# Altium project US29080671(A).PrjPCB (part 5 of 10)

## Sheet Z7_BLOCK.SchDoc
size A4
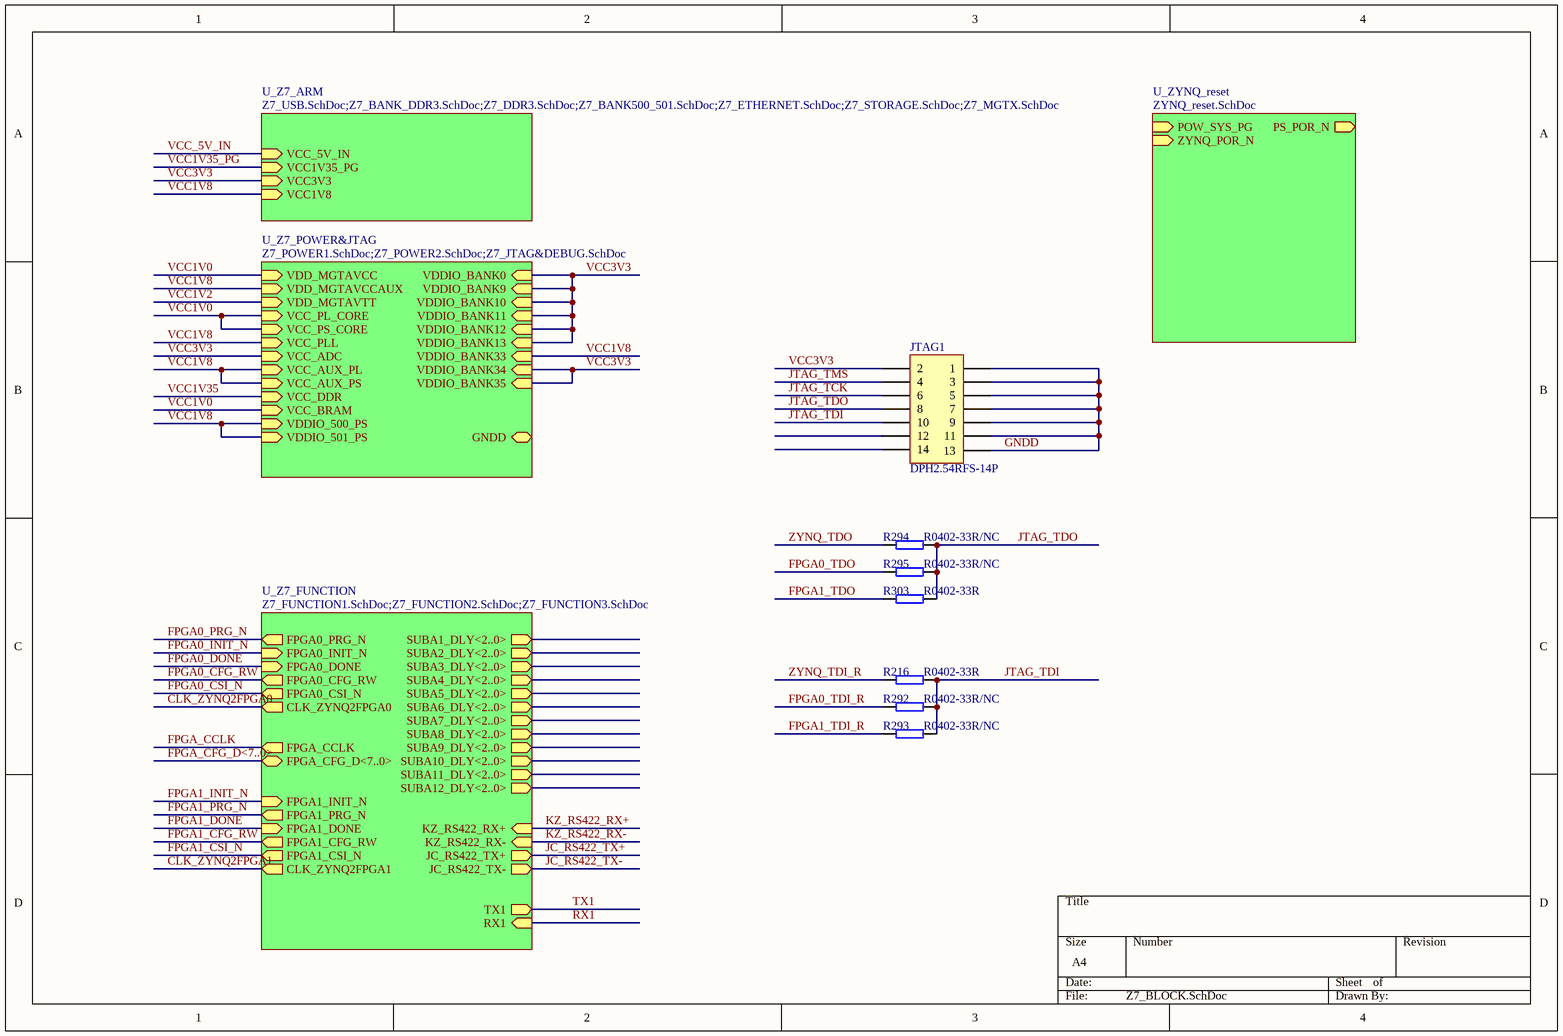
[diagram p22: Z7_BLOCK.SchDoc]

### Parts
JTAG1  DPH2.54RFS-14P  [IDC2.54-14]
R216  R0402-33R  [R0402]
R292  R0402-33R/NC  [R0402]
R293  R0402-33R/NC  [R0402]
R294  R0402-33R/NC  [R0402]
R295  R0402-33R/NC  [R0402]
R303  R0402-33R  [R0402]

### Sub-sheets
U_Z7_ARM = Z7_USB.SchDoc;Z7_BANK_DDR3.SchDoc;Z7_DDR3.SchDoc;Z7_BANK500_501.SchDoc;Z7_ETHERNET.SchDoc;Z7_STORAGE.SchDoc;Z7_MGTX.SchDoc: VCC_5V_IN (in), VCC1V35_PG (in), VCC3V3 (in), VCC1V8 (in)
U_Z7_FUNCTION = Z7_FUNCTION1.SchDoc;Z7_FUNCTION2.SchDoc;Z7_FUNCTION3.SchDoc: FPGA0_PRG_N (out), FPGA0_INIT_N (in), FPGA0_DONE (in), FPGA0_CFG_RW (out), FPGA0_CSI_N (out), FPGA_CCLK (out), FPGA_CFG_D<7..0> (bidir), JC_RS422_TX+ (out), JC_RS422_TX- (out), KZ_RS422_RX- (in), KZ_RS422_RX+ (in), FPGA1_INIT_N (in), FPGA1_PRG_N (out), FPGA1_DONE (in), FPGA1_CFG_RW (out), FPGA1_CSI_N (out), CLK_ZYNQ2FPGA0 (out), CLK_ZYNQ2FPGA1 (out), SUBA1_DLY<2..0> (out), SUBA2_DLY<2..0> (out), SUBA3_DLY<2..0> (out), SUBA4_DLY<2..0> (out), SUBA5_DLY<2..0> (out), SUBA6_DLY<2..0> (out), SUBA7_DLY<2..0> (out), SUBA8_DLY<2..0> (out), SUBA9_DLY<2..0> (out), SUBA10_DLY<2..0> (out), SUBA11_DLY<2..0> (out), SUBA12_DLY<2..0> (out), TX1 (out), RX1 (in)
U_Z7_POWER&JTAG = Z7_POWER1.SchDoc;Z7_POWER2.SchDoc;Z7_JTAG&DEBUG.SchDoc: VDD_MGTAVCC (in), VDD_MGTAVCCAUX (in), VDD_MGTAVTT (in), VCC_PL_CORE (in), VCC_PS_CORE (in), VDDIO_501_PS (in), VCC_PLL (in), VCC_ADC (in), VCC_AUX_PL (in), VCC_AUX_PS (in), VCC_DDR (in), VCC_BRAM (in), VDDIO_500_PS (in), GNDD, VDDIO_BANK0 (in), VDDIO_BANK9 (in), VDDIO_BANK10 (in), VDDIO_BANK11 (in), VDDIO_BANK13 (in), VDDIO_BANK33 (in), VDDIO_BANK34 (in), VDDIO_BANK35 (in), VDDIO_BANK12 (in)
U_ZYNQ_reset = ZYNQ_reset.SchDoc: POW_SYS_PG (in), ZYNQ_POR_N (in), PS_POR_N (out)

### Nets
GNDD: JTAG1.1 JTAG1.3 JTAG1.5 JTAG1.7 JTAG1.9 JTAG1.11 JTAG1.13
VCC1V0: sheet U_Z7_POWER&JTAG/VDD_MGTAVCC, sheet U_Z7_POWER&JTAG/VCC_PL_CORE, sheet U_Z7_POWER&JTAG/VCC_PS_CORE, sheet U_Z7_POWER&JTAG/VCC_BRAM
VCC1V8: sheet U_Z7_POWER&JTAG/VDD_MGTAVCCAUX, sheet U_Z7_POWER&JTAG/VDDIO_501_PS, sheet U_Z7_POWER&JTAG/VCC_PLL, sheet U_Z7_POWER&JTAG/VCC_AUX_PL, sheet U_Z7_POWER&JTAG/VCC_AUX_PS, sheet U_Z7_POWER&JTAG/VDDIO_500_PS, sheet U_Z7_POWER&JTAG/VDDIO_BANK33, sheet U_Z7_ARM/VCC1V8
VCC3V3: JTAG1.2 ; sheet U_Z7_POWER&JTAG/VCC_ADC, sheet U_Z7_POWER&JTAG/VDDIO_BANK0, sheet U_Z7_POWER&JTAG/VDDIO_BANK9, sheet U_Z7_POWER&JTAG/VDDIO_BANK10, sheet U_Z7_POWER&JTAG/VDDIO_BANK11, sheet U_Z7_POWER&JTAG/VDDIO_BANK13, sheet U_Z7_POWER&JTAG/VDDIO_BANK34, sheet U_Z7_POWER&JTAG/VDDIO_BANK35, sheet U_Z7_POWER&JTAG/VDDIO_BANK12, sheet U_Z7_ARM/VCC3V3
FPGA0_TDI_R: R292.1
FPGA0_TDO: R295.1
FPGA1_TDI_R: R293.1
FPGA1_TDO: R303.1
JTAG_TCK: JTAG1.6
JTAG_TDI: JTAG1.10 R216.2 R292.2 R293.2
JTAG_TDO: JTAG1.8 R294.2 R295.2 R303.2
JTAG_TMS: JTAG1.4
ZYNQ_TDI_R: R216.1
ZYNQ_TDO: R294.1

Not connected (* = marked no-connect by the designer): JTAG1 12 14

### Buses and harness runs
bus FPGA_CFG_D<7..0> = sheet U_Z7_FUNCTION/FPGA_CFG_D<7..0>

### Library data of the parts
JTAG1 = DPH2.54RFS-14P: 2.54间距14芯双排插针; Part_type: CONNECTOR; Manufacture: ANYCONN; Revision: 17-Jul-2002: Re-released for DXP Platform.; Part_number: DPH2.54RFS-14P; Value: DPH2.54RFS-14P; Schematic_Part: DPH2.54RFS-14P; PCB_Footprint: IDC2.54-14; datasheet: DataSheet\CON_ANYCONN_2.54 直针座.pdf#DataSheet\CON_ANYCONN_2.54%20直针座.pdf#
R216 R292-R295 R303 = R0402-10K: Manufacturer: SAMSUNG; Part_type: RES; Schematic_Part: RES; PCB_Footprint: R0402
  R216 R303: Part_number: R0402-33R; Value: R0402-33R
  R292-R295: Part_number: R0402-33R/NC; Value: R0402-33R/NC

## Sheet Z7_POWER1.SchDoc
size A3
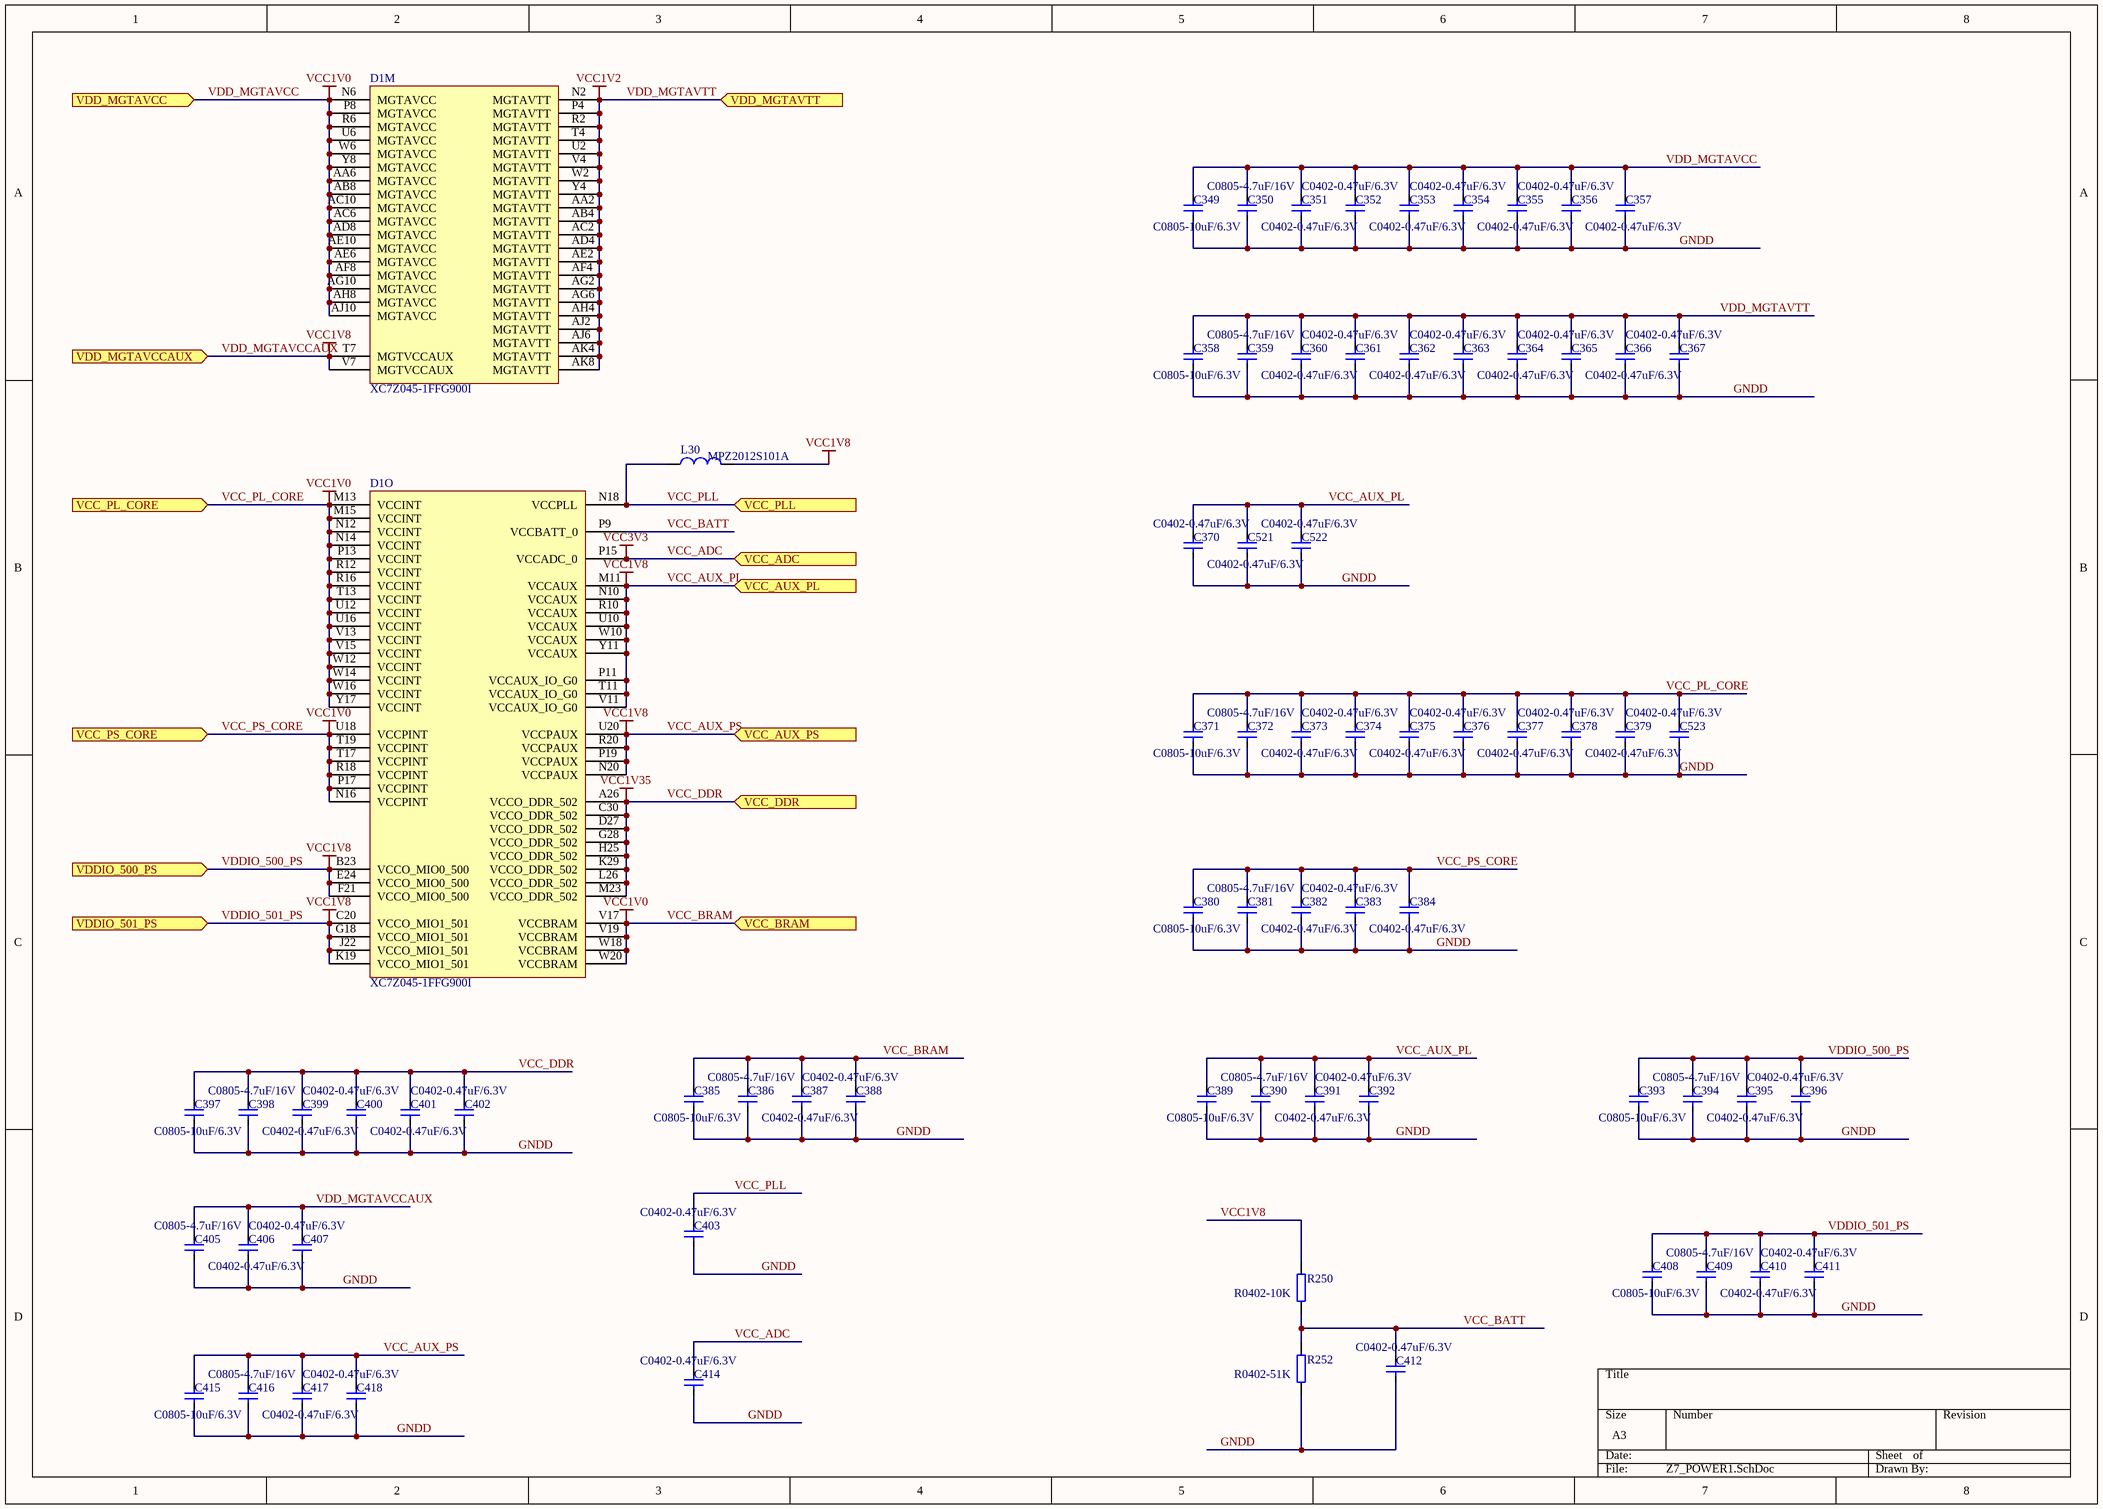
[diagram p23: Z7_POWER1.SchDoc]

### Parts
C349  C0805-10uF/6.3V  [C0805]
C350  C0805-4.7uF/16V  [C0805]
C351  C0402-0.47uF/6.3V  [C0402]
C352  C0402-0.47uF/6.3V  [C0402]
C353  C0402-0.47uF/6.3V  [C0402]
C354  C0402-0.47uF/6.3V  [C0402]
C355  C0402-0.47uF/6.3V  [C0402]
C356  C0402-0.47uF/6.3V  [C0402]
C357  C0402-0.47uF/6.3V  [C0402]
C358  C0805-10uF/6.3V  [C0805]
C359  C0805-4.7uF/16V  [C0805]
C360  C0402-0.47uF/6.3V  [C0402]
C361  C0402-0.47uF/6.3V  [C0402]
C362  C0402-0.47uF/6.3V  [C0402]
C363  C0402-0.47uF/6.3V  [C0402]
C364  C0402-0.47uF/6.3V  [C0402]
C365  C0402-0.47uF/6.3V  [C0402]
C366  C0402-0.47uF/6.3V  [C0402]
C367  C0402-0.47uF/6.3V  [C0402]
C370  C0402-0.47uF/6.3V  [C0402]
C371  C0805-10uF/6.3V  [C0805]
C372  C0805-4.7uF/16V  [C0805]
C373  C0402-0.47uF/6.3V  [C0402]
C374  C0402-0.47uF/6.3V  [C0402]
C375  C0402-0.47uF/6.3V  [C0402]
C376  C0402-0.47uF/6.3V  [C0402]
C377  C0402-0.47uF/6.3V  [C0402]
C378  C0402-0.47uF/6.3V  [C0402]
C379  C0402-0.47uF/6.3V  [C0402]
C380  C0805-10uF/6.3V  [C0805]
C381  C0805-4.7uF/16V  [C0805]
C382  C0402-0.47uF/6.3V  [C0402]
C383  C0402-0.47uF/6.3V  [C0402]
C384  C0402-0.47uF/6.3V  [C0402]
C385  C0805-10uF/6.3V  [C0805]
C386  C0805-4.7uF/16V  [C0805]
C387  C0402-0.47uF/6.3V  [C0402]
C388  C0402-0.47uF/6.3V  [C0402]
C389  C0805-10uF/6.3V  [C0805]
C390  C0805-4.7uF/16V  [C0805]
C391  C0402-0.47uF/6.3V  [C0402]
C392  C0402-0.47uF/6.3V  [C0402]
C393  C0805-10uF/6.3V  [C0805]
C394  C0805-4.7uF/16V  [C0805]
C395  C0402-0.47uF/6.3V  [C0402]
C396  C0402-0.47uF/6.3V  [C0402]
C397  C0805-10uF/6.3V  [C0805]
C398  C0805-4.7uF/16V  [C0805]
C399  C0402-0.47uF/6.3V  [C0402]
C400  C0402-0.47uF/6.3V  [C0402]
C401  C0402-0.47uF/6.3V  [C0402]
C402  C0402-0.47uF/6.3V  [C0402]
C403  C0402-0.47uF/6.3V  [C0402]
C405  C0805-4.7uF/16V  [C0805]
C406  C0402-0.47uF/6.3V  [C0402]
C407  C0402-0.47uF/6.3V  [C0402]
C408  C0805-10uF/6.3V  [C0805]
C409  C0805-4.7uF/16V  [C0805]
C410  C0402-0.47uF/6.3V  [C0402]
C411  C0402-0.47uF/6.3V  [C0402]
C412  C0402-0.47uF/6.3V  [C0402]
C414  C0402-0.47uF/6.3V  [C0402]
C415  C0805-10uF/6.3V  [C0805]
C416  C0805-4.7uF/16V  [C0805]
C417  C0402-0.47uF/6.3V  [C0402]
C418  C0402-0.47uF/6.3V  [C0402]
C521  C0402-0.47uF/6.3V  [C0402]
C522  C0402-0.47uF/6.3V  [C0402]
C523  C0402-0.47uF/6.3V  [C0402]
D1  XC7Z045-1FFG900I  [FFG900]  (parts M,O of 16)
L30  MPZ2012S101A  [R0805]
R250  R0402-10K  [R0402]
R252  R0402-51K  [R0402]

### Ports
VCC_ADC (in), VCC_AUX_PL (in), VCC_AUX_PS (in), VCC_BRAM (in), VCC_DDR (in), VCC_PL_CORE (in), VCC_PLL (in), VCC_PS_CORE (in), VDD_MGTAVCC (in), VDD_MGTAVCCAUX (in), VDD_MGTAVTT (in), VDDIO_500_PS (in), VDDIO_501_PS (in)

### Nets
GNDD: C349.2 C350.2 C351.2 C352.2 C353.2 C354.2 C355.2 C356.2 C357.2 C358.2 C359.2 C360.2 C361.2 C362.2 C363.2 C364.2 C365.2 C366.2 C367.2 C370.2 C371.2 C372.2 C373.2 C374.2 C375.2 C376.2 C377.2 C378.2 C379.2 C380.2 C381.2 C382.2 C383.2 C384.2 C385.2 C386.2 C387.2 C388.2 C389.2 C390.2 C391.2 C392.2 C393.2 C394.2 C395.2 C396.2 C397.2 C398.2 C399.2 C400.2 C401.2 C402.2 C403.2 C405.2 C406.2 C407.2 C408.2 C409.2 C410.2 C411.2 C412.2 C414.2 C415.2 C416.2 C417.2 C418.2 C521.2 C522.2 C523.2 R252.1
VCC1V0: C349.1 C350.1 C351.1 C352.1 C353.1 C354.1 C355.1 C356.1 C357.1 C371.1 C372.1 C373.1 C374.1 C375.1 C376.1 C377.1 C378.1 C379.1 C380.1 C381.1 C382.1 C383.1 C384.1 C385.1 C386.1 C387.1 C388.1 C523.1 D1.AA6(MGTAVCC) D1.AB8(MGTAVCC) D1.AC6(MGTAVCC) D1.AC10(MGTAVCC) D1.AD8(MGTAVCC) D1.AE6(MGTAVCC) D1.AE10(MGTAVCC) D1.AF8(MGTAVCC) D1.AG10(MGTAVCC) D1.AH8(MGTAVCC) D1.AJ10(MGTAVCC) D1.M13(VCCINT) D1.M15(VCCINT) D1.N6(MGTAVCC) D1.N12(VCCINT) D1.N14(VCCINT) D1.N16(VCCPINT) D1.P8(MGTAVCC) D1.P13(VCCINT) D1.P17(VCCPINT) D1.R6(MGTAVCC) D1.R12(VCCINT) D1.R16(VCCINT) D1.R18(VCCPINT) D1.T13(VCCINT) D1.T17(VCCPINT) D1.T19(VCCPINT) D1.U6(MGTAVCC) D1.U12(VCCINT) D1.U16(VCCINT) D1.U18(VCCPINT) D1.V13(VCCINT) D1.V15(VCCINT) D1.V17(VCCBRAM) D1.V19(VCCBRAM) D1.W6(MGTAVCC) D1.W12(VCCINT) D1.W14(VCCINT) D1.W16(VCCINT) D1.W18(VCCBRAM) D1.W20(VCCBRAM) D1.Y8(MGTAVCC) D1.Y17(VCCINT) ; port VDD_MGTAVCC, port VCC_PL_CORE, port VCC_PS_CORE, port VCC_BRAM  [also labelled VCC_BRAM, VCC_PL_CORE, VCC_PS_CORE, VDD_MGTAVCC]
VCC1V2: C358.1 C359.1 C360.1 C361.1 C362.1 C363.1 C364.1 C365.1 C366.1 C367.1 D1.AA2(MGTAVTT) D1.AB4(MGTAVTT) D1.AC2(MGTAVTT) D1.AD4(MGTAVTT) D1.AE2(MGTAVTT) D1.AF4(MGTAVTT) D1.AG2(MGTAVTT) D1.AG6(MGTAVTT) D1.AH4(MGTAVTT) D1.AJ2(MGTAVTT) D1.AJ6(MGTAVTT) D1.AK4(MGTAVTT) D1.AK8(MGTAVTT) D1.N2(MGTAVTT) D1.P4(MGTAVTT) D1.R2(MGTAVTT) D1.T4(MGTAVTT) D1.U2(MGTAVTT) D1.V4(MGTAVTT) D1.W2(MGTAVTT) D1.Y4(MGTAVTT) ; port VDD_MGTAVTT  [also labelled VDD_MGTAVTT]
VCC1V8: C370.1 C389.1 C390.1 C391.1 C392.1 C393.1 C394.1 C395.1 C396.1 C405.1 C406.1 C407.1 C408.1 C409.1 C410.1 C411.1 C415.1 C416.1 C417.1 C418.1 C521.1 C522.1 D1.B23(VCCO_MIO0_500) D1.C20(VCCO_MIO1_501) D1.E24(VCCO_MIO0_500) D1.F21(VCCO_MIO0_500) D1.G18(VCCO_MIO1_501) D1.J22(VCCO_MIO1_501) D1.K19(VCCO_MIO1_501) D1.M11(VCCAUX) D1.N10(VCCAUX) D1.N20(VCCPAUX) D1.P11(VCCAUX_IO_G0) D1.P19(VCCPAUX) D1.R10(VCCAUX) D1.R20(VCCPAUX) D1.T7(MGTVCCAUX) D1.T11(VCCAUX_IO_G0) D1.U10(VCCAUX) D1.U20(VCCPAUX) D1.V7(MGTVCCAUX) D1.V11(VCCAUX_IO_G0) D1.W10(VCCAUX) D1.Y11(VCCAUX) L30.2 R250.2 ; port VDD_MGTAVCCAUX, port VDDIO_501_PS, port VCC_AUX_PL, port VCC_AUX_PS, port VDDIO_500_PS  [also labelled VCC_AUX_PL, VCC_AUX_PS, VDD_MGTAVCCAUX, VDDIO_500_PS, VDDIO_501_PS]
VCC1V35: C397.1 C398.1 C399.1 C400.1 C401.1 C402.1 D1.A26(VCCO_DDR_502) D1.C30(VCCO_DDR_502) D1.D27(VCCO_DDR_502) D1.G28(VCCO_DDR_502) D1.H25(VCCO_DDR_502) D1.K29(VCCO_DDR_502) D1.L26(VCCO_DDR_502) D1.M23(VCCO_DDR_502) ; port VCC_DDR  [also labelled VCC_DDR]
VCC3V3: C414.1 D1.P15(VCCADC_0) ; port VCC_ADC  [also labelled VCC_ADC]
VCC_BATT: C412.1 D1.P9(VCCBATT_0) R250.1 R252.2
VCC_PLL: C403.1 D1.N18(VCCPLL) L30.1 ; port VCC_PLL

### Library data of the parts
C349 C358 C371 C380 C385 C389 C393 C397 C408 C415 = C1210-22uF/16V: Part_number: C0805-10uF/6.3V; Part_type: CAP; Value: C0805-10uF/6.3V; Schematic_Part: CAP; PCB_Footprint: C0805
C350 C359 C372 C381 C386 C390 C394 C398 C405 C409 C416 = C0805-4.7uF/50V: X7R; Manufacturer: SAMSUNG; Part_number: C0805-4.7uF/16V; Part_type: CAP; Value: C0805-4.7uF/16V; Schematic_Part: CAP; PCB_Footprint: C0805; datasheet: #DataSheet\C_Samsung_General Capacitors.pdf#
C351-C357 C360-C367 C370 C373-C379 C382-C384 C387 C388 C391 C392 C395 C396 C399-C403 C406 C407 C410-C412 C414 C417 C418 C521-C523 = C0402-0.1uF/16V: X7R; Manufacturer: SAMSUNG; Manufacturer_p/n: CL05X7R104KO5NNN; Part_number: C0402-0.47uF/6.3V; Part_type: CAP; Value: C0402-0.47uF/6.3V; temperature: -55℃\+125℃; Schematic_Part: CAP; PCB_Footprint: C0402; datasheet: #DataSheet\C_Samsung_General Capacitors.pdf#
D1 = XC7Z045-1FFG900I: 667 MHz Zynq?7000 AP SoC, 130 PS I/O, 378 FPGA I/O, 900-Ball BGA, Speed Grade 1, Industrial Grade, Pb-Free; Manufacturer: Xilinx; Extensible Block RAM (# 36Kb Blocks): 2180 KB (545); Flip Flops: 437200; LUTs: 218600; Speed Grade: -1; DatasheetVersion: v1.2; PackageVersion: Rev 1.1; PackageReference: FFG900; PackageDescription: Flip-Chip BGA, Body 31 x 31 mm, 1.0 mm Pitch; Generic Part Number: XC7Z045; RoHS: Pb-Free; Mounting Technology: Surface Mount; Code_JEDEC: MS-034-AAN-1; PartNumber: XC7Z045-1FFG900I; ComponentLink1Description: Datasheet; ComponentLink1URL: http://www.xilinx.com/support/documentation/data_sheets/ds190-Zynq-7000-Overview.pdf; ComponentLink2Description: Package Specification; ComponentLink2URL: http://www.xilinx.com/support/documentation/user_guides/ug865-Zynq-7000-Pkg-Pinout.pdf; ComponentLink3Description: DC and AC Switching Characteristics; ComponentLink3URL: http://www.xilinx.com/support/documentation/data_sheets/ds191-XC7Z030-XC7Z045-data-sheet.pdf; ComponentLink4Description: Package File; ComponentLink4URL: http://www.xilinx.com/support/packagefiles/z7packages/xc7z045ffg900pkg.txt; ComponentLink5Description: Packaging and Pinout; ComponentLink5URL: http://www.xilinx.com/support/documentation/user_guides/ug865-Zynq-7000-Pkg-Pinout.pdf; ComponentLink6Description: PCB and Layout Guide; ComponentLink6URL: http://www.xilinx.com/support/documentation/user_guides/ug483_7Series_PCB.pdf
L30 = FB0805-330R@100MHz: Manufacturer: TDK; Part_number: MPZ2012S101A; Part_type: BEAD; temperature: -55℃\+125℃; Value1: 330R@100MHz; Schematic_Part: BEAD; PCB_Footprint: R0805; Manufacturer_p/n: MPZ2012S101A
R250 R252 = R0402-10K: Manufacturer: SAMSUNG; Part_type: RES; Schematic_Part: RES; PCB_Footprint: R0402
  R250: Part_number: R0402-10K; Value: R0402-10K
  R252: Part_number: R0402-51K; Value: R0402-51K

## Sheet Z7_POWER2.SchDoc
size A3
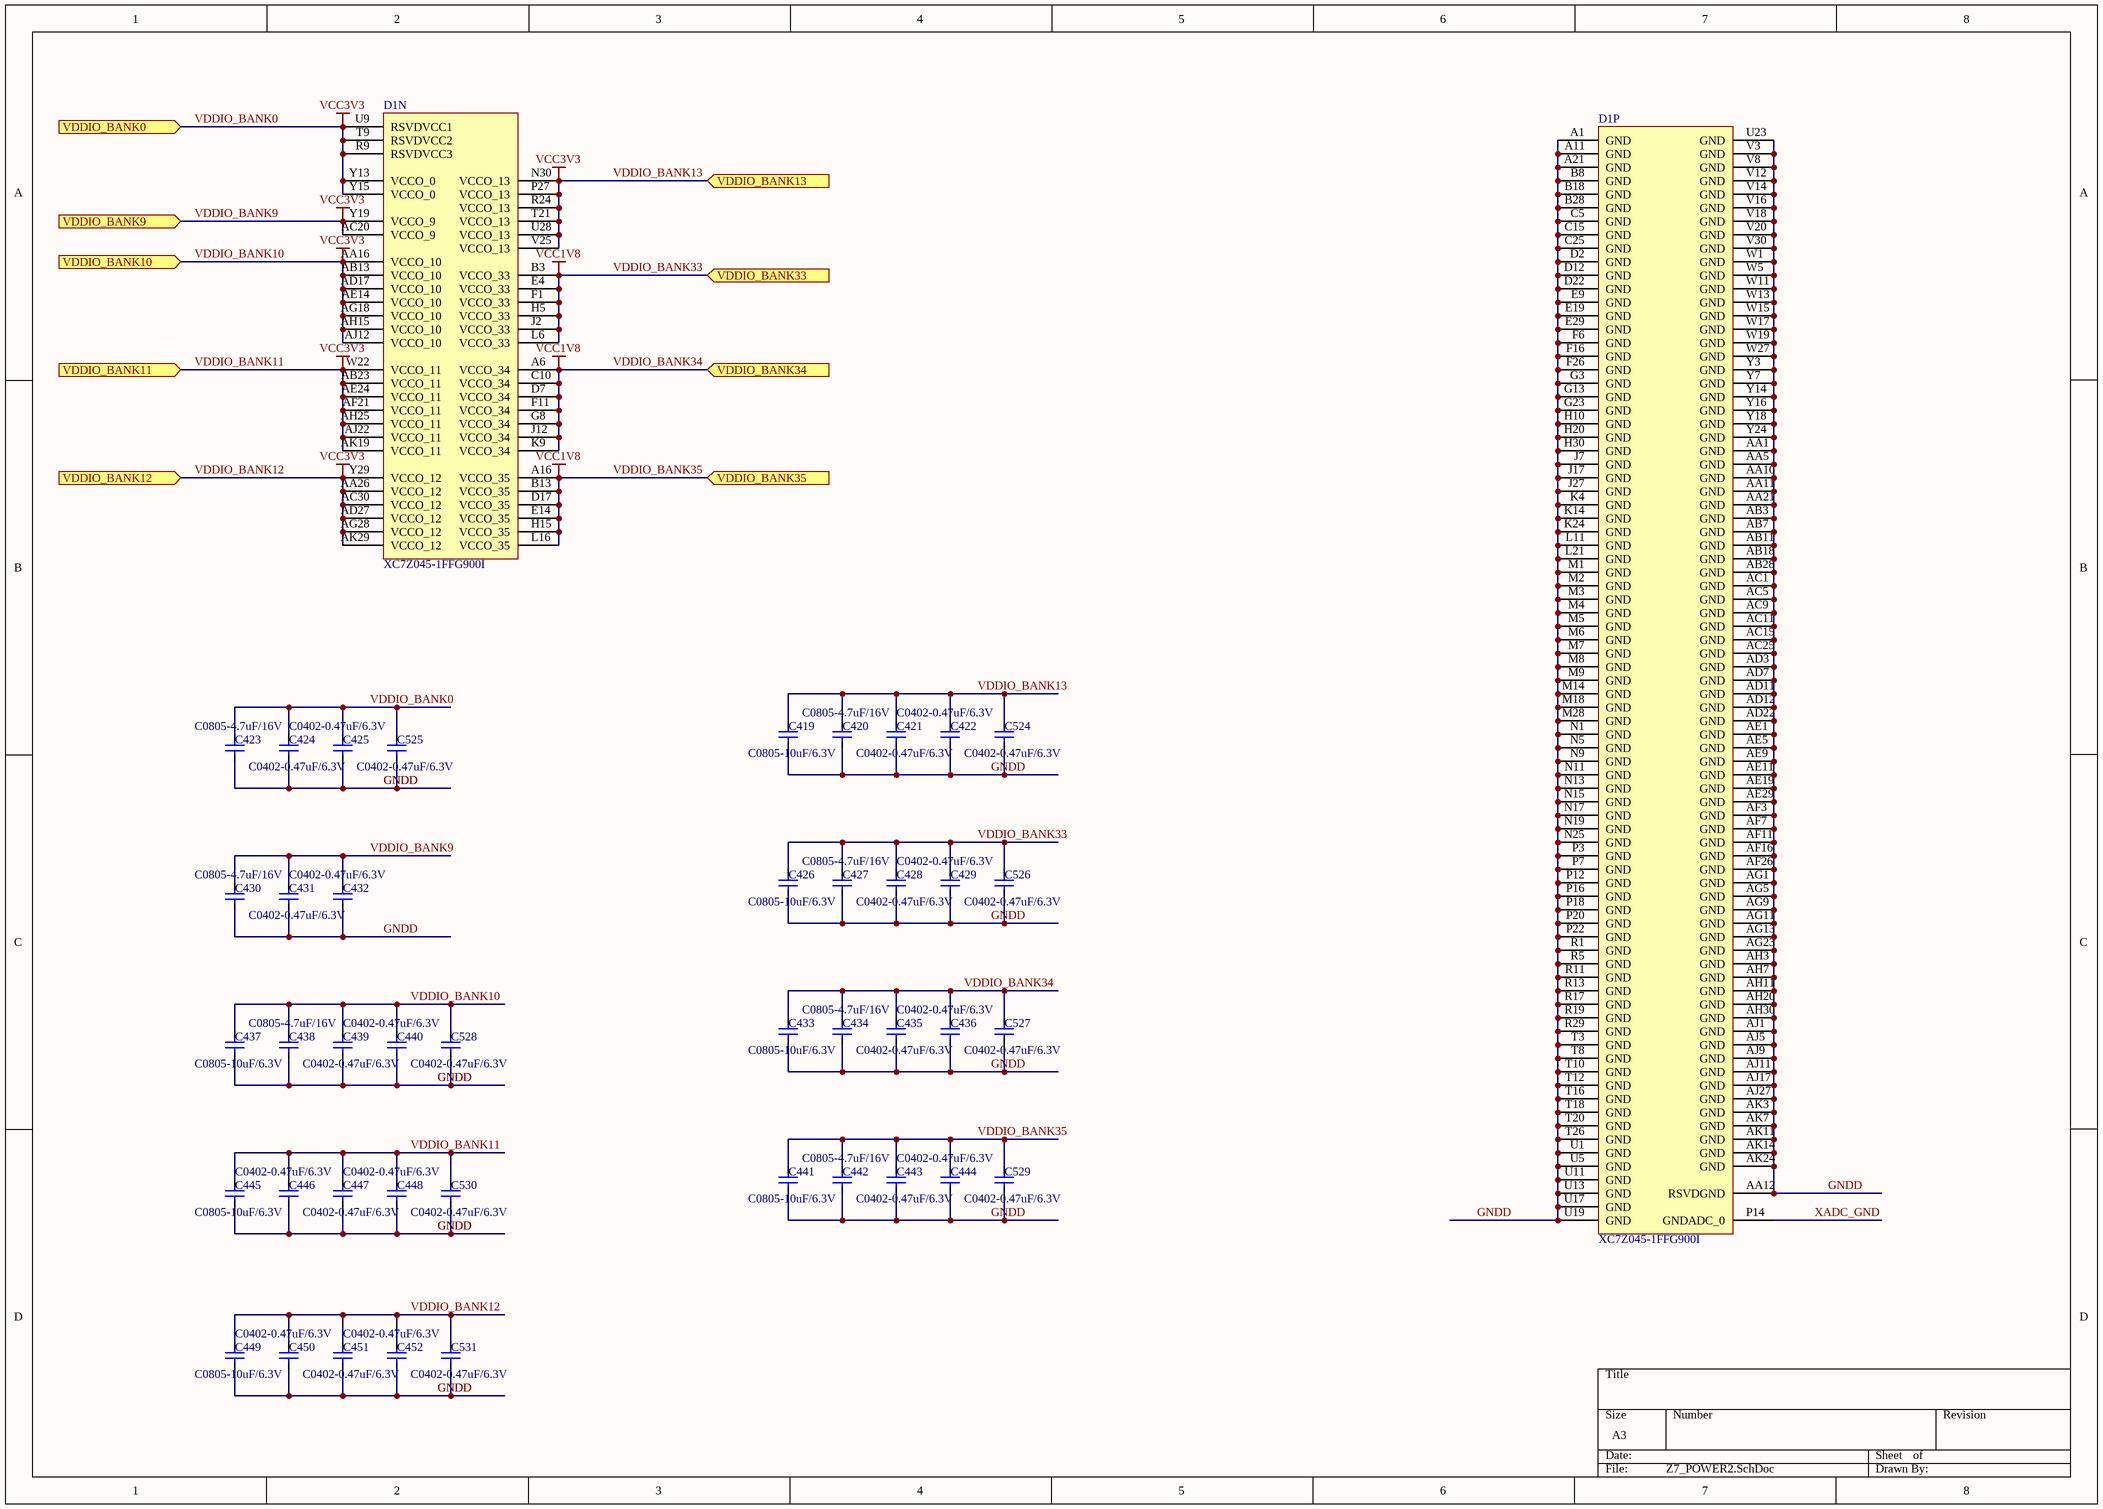
[diagram p24: Z7_POWER2.SchDoc]

### Parts
C419  C0805-10uF/6.3V  [C0805]
C420  C0805-4.7uF/16V  [C0805]
C421  C0402-0.47uF/6.3V  [C0402]
C422  C0402-0.47uF/6.3V  [C0402]
C423  C0805-4.7uF/16V  [C0805]
C424  C0402-0.47uF/6.3V  [C0402]
C425  C0402-0.47uF/6.3V  [C0402]
C426  C0805-10uF/6.3V  [C0805]
C427  C0805-4.7uF/16V  [C0805]
C428  C0402-0.47uF/6.3V  [C0402]
C429  C0402-0.47uF/6.3V  [C0402]
C430  C0805-4.7uF/16V  [C0805]
C431  C0402-0.47uF/6.3V  [C0402]
C432  C0402-0.47uF/6.3V  [C0402]
C433  C0805-10uF/6.3V  [C0805]
C434  C0805-4.7uF/16V  [C0805]
C435  C0402-0.47uF/6.3V  [C0402]
C436  C0402-0.47uF/6.3V  [C0402]
C437  C0805-10uF/6.3V  [C0805]
C438  C0805-4.7uF/16V  [C0805]
C439  C0402-0.47uF/6.3V  [C0402]
C440  C0402-0.47uF/6.3V  [C0402]
C441  C0805-10uF/6.3V  [C0805]
C442  C0805-4.7uF/16V  [C0805]
C443  C0402-0.47uF/6.3V  [C0402]
C444  C0402-0.47uF/6.3V  [C0402]
C445  C0805-10uF/6.3V  [C0805]
C446  C0402-0.47uF/6.3V  [C0402]
C447  C0402-0.47uF/6.3V  [C0402]
C448  C0402-0.47uF/6.3V  [C0402]
C449  C0805-10uF/6.3V  [C0805]
C450  C0402-0.47uF/6.3V  [C0402]
C451  C0402-0.47uF/6.3V  [C0402]
C452  C0402-0.47uF/6.3V  [C0402]
C524  C0402-0.47uF/6.3V  [C0402]
C525  C0402-0.47uF/6.3V  [C0402]
C526  C0402-0.47uF/6.3V  [C0402]
C527  C0402-0.47uF/6.3V  [C0402]
C528  C0402-0.47uF/6.3V  [C0402]
C529  C0402-0.47uF/6.3V  [C0402]
C530  C0402-0.47uF/6.3V  [C0402]
C531  C0402-0.47uF/6.3V  [C0402]
D1  XC7Z045-1FFG900I  [FFG900]  (parts N,P of 16)

### Ports
VDDIO_BANK0 (in), VDDIO_BANK9 (in), VDDIO_BANK10 (in), VDDIO_BANK11 (in), VDDIO_BANK12 (in), VDDIO_BANK13 (in), VDDIO_BANK33 (in), VDDIO_BANK34 (in), VDDIO_BANK35 (in)

### Nets
GNDD: C419.2 C420.2 C421.2 C422.2 C423.2 C424.2 C425.2 C426.2 C427.2 C428.2 C429.2 C430.2 C431.2 C432.2 C433.2 C434.2 C435.2 C436.2 C437.2 C438.2 C439.2 C440.2 C441.2 C442.2 C443.2 C444.2 C445.2 C446.2 C447.2 C448.2 C449.2 C450.2 C451.2 C452.2 C524.2 C525.2 C526.2 C527.2 C528.2 C529.2 C530.2 C531.2 D1.A1(GND) D1.A11(GND) D1.A21(GND) D1.AA1(GND) D1.AA5(GND) D1.AA10(GND) D1.AA11(GND) D1.AA12(RSVDGND) D1.AA21(GND) D1.AB3(GND) D1.AB7(GND) D1.AB11(GND) D1.AB18(GND) D1.AB28(GND) D1.AC1(GND) D1.AC5(GND) D1.AC9(GND) D1.AC11(GND) D1.AC15(GND) D1.AC25(GND) D1.AD3(GND) D1.AD7(GND) D1.AD11(GND) D1.AD12(GND) D1.AD22(GND) D1.AE1(GND) D1.AE5(GND) D1.AE9(GND) D1.AE11(GND) D1.AE19(GND) D1.AE29(GND) D1.AF3(GND) D1.AF7(GND) D1.AF11(GND) D1.AF16(GND) D1.AF26(GND) D1.AG1(GND) D1.AG5(GND) D1.AG9(GND) D1.AG11(GND) D1.AG13(GND) D1.AG23(GND) D1.AH3(GND) D1.AH7(GND) D1.AH11(GND) D1.AH20(GND) D1.AH30(GND) D1.AJ1(GND) D1.AJ5(GND) D1.AJ9(GND) D1.AJ11(GND) D1.AJ17(GND) D1.AJ27(GND) D1.AK3(GND) D1.AK7(GND) D1.AK11(GND) D1.AK14(GND) D1.AK24(GND) D1.B8(GND) D1.B18(GND) D1.B28(GND) D1.C5(GND) D1.C15(GND) D1.C25(GND) D1.D2(GND) D1.D12(GND) D1.D22(GND) D1.E9(GND) D1.E19(GND) D1.E29(GND) D1.F6(GND) D1.F16(GND) D1.F26(GND) D1.G3(GND) D1.G13(GND) D1.G23(GND) D1.H10(GND) D1.H20(GND) D1.H30(GND) D1.J7(GND) D1.J17(GND) D1.J27(GND) D1.K4(GND) D1.K14(GND) D1.K24(GND) D1.L11(GND) D1.L21(GND) D1.M1(GND) D1.M2(GND) D1.M3(GND) D1.M4(GND) D1.M5(GND) D1.M6(GND) D1.M7(GND) D1.M8(GND) D1.M9(GND) D1.M14(GND) D1.M18(GND) D1.M28(GND) D1.N1(GND) D1.N5(GND) D1.N9(GND) D1.N11(GND) D1.N13(GND) D1.N15(GND) D1.N17(GND) D1.N19(GND) D1.N25(GND) D1.P3(GND) D1.P7(GND) D1.P12(GND) D1.P16(GND) D1.P18(GND) D1.P20(GND) D1.P22(GND) D1.R1(GND) D1.R5(GND) D1.R11(GND) D1.R13(GND) D1.R17(GND) D1.R19(GND) D1.R29(GND) D1.T3(GND) D1.T8(GND) D1.T10(GND) D1.T12(GND) D1.T16(GND) D1.T18(GND) D1.T20(GND) D1.T26(GND) D1.U1(GND) D1.U5(GND) D1.U11(GND) D1.U13(GND) D1.U17(GND) D1.U19(GND) D1.U23(GND) D1.V3(GND) D1.V8(GND) D1.V12(GND) D1.V14(GND) D1.V16(GND) D1.V18(GND) D1.V20(GND) D1.V30(GND) D1.W1(GND) D1.W5(GND) D1.W11(GND) D1.W13(GND) D1.W15(GND) D1.W17(GND) D1.W19(GND) D1.W27(GND) D1.Y3(GND) D1.Y7(GND) D1.Y14(GND) D1.Y16(GND) D1.Y18(GND) D1.Y24(GND)
VCC1V8: C426.1 C427.1 C428.1 C429.1 C433.1 C434.1 C435.1 C436.1 C441.1 C442.1 C443.1 C444.1 C526.1 C527.1 C529.1 D1.A6(VCCO_34) D1.A16(VCCO_35) D1.B3(VCCO_33) D1.B13(VCCO_35) D1.C10(VCCO_34) D1.D7(VCCO_34) D1.D17(VCCO_35) D1.E4(VCCO_33) D1.E14(VCCO_35) D1.F1(VCCO_33) D1.F11(VCCO_34) D1.G8(VCCO_34) D1.H5(VCCO_33) D1.H15(VCCO_35) D1.J2(VCCO_33) D1.J12(VCCO_34) D1.K9(VCCO_34) D1.L6(VCCO_33) D1.L16(VCCO_35) ; port VDDIO_BANK33, port VDDIO_BANK34, port VDDIO_BANK35  [also labelled VDDIO_BANK33, VDDIO_BANK34, VDDIO_BANK35]
VCC3V3: C419.1 C420.1 C421.1 C422.1 C423.1 C424.1 C425.1 C430.1 C431.1 C432.1 C437.1 C438.1 C439.1 C440.1 C445.1 C446.1 C447.1 C448.1 C449.1 C450.1 C451.1 C452.1 C524.1 C525.1 C528.1 C530.1 C531.1 D1.AA16(VCCO_10) D1.AA26(VCCO_12) D1.AB13(VCCO_10) D1.AB23(VCCO_11) D1.AC20(VCCO_9) D1.AC30(VCCO_12) D1.AD17(VCCO_10) D1.AD27(VCCO_12) D1.AE14(VCCO_10) D1.AE24(VCCO_11) D1.AF21(VCCO_11) D1.AG18(VCCO_10) D1.AG28(VCCO_12) D1.AH15(VCCO_10) D1.AH25(VCCO_11) D1.AJ12(VCCO_10) D1.AJ22(VCCO_11) D1.AK19(VCCO_11) D1.AK29(VCCO_12) D1.N30(VCCO_13) D1.P27(VCCO_13) D1.R9(RSVDVCC3) D1.R24(VCCO_13) D1.T9(RSVDVCC2) D1.T21(VCCO_13) D1.U9(RSVDVCC1) D1.U28(VCCO_13) D1.V25(VCCO_13) D1.W22(VCCO_11) D1.Y13(VCCO_0) D1.Y15(VCCO_0) D1.Y19(VCCO_9) D1.Y29(VCCO_12) ; port VDDIO_BANK0, port VDDIO_BANK9, port VDDIO_BANK10, port VDDIO_BANK11, port VDDIO_BANK13, port VDDIO_BANK12  [also labelled VDDIO_BANK0, VDDIO_BANK10, VDDIO_BANK11, VDDIO_BANK12, VDDIO_BANK13, VDDIO_BANK9]
XADC_GND: D1.P14(GNDADC_0)

### Library data of the parts
C419 C426 C433 C437 C441 C445 C449 = C1210-22uF/16V: Part_number: C0805-10uF/6.3V; Part_type: CAP; Value: C0805-10uF/6.3V; Schematic_Part: CAP; PCB_Footprint: C0805
C420 C423 C427 C430 C434 C438 C442 = C0805-4.7uF/50V: X7R; Manufacturer: SAMSUNG; Part_number: C0805-4.7uF/16V; Part_type: CAP; Value: C0805-4.7uF/16V; Schematic_Part: CAP; PCB_Footprint: C0805; datasheet: #DataSheet\C_Samsung_General Capacitors.pdf#
C421 C422 C424 C425 C428 C429 C431 C432 C435 C436 C439 C440 C443 C444 C446-C448 C450-C452 C524-C531 = C0402-0.1uF/16V: as C351-C357 on sheet Z7_POWER1; Part_number: C0402-0.47uF/6.3V; Part_type: CAP; Value: C0402-0.47uF/6.3V; temperature: -55℃\+125℃; Schematic_Part: CAP; PCB_Footprint: C0402; datasheet: #DataSheet\C_Samsung_General Capacitors.pdf#
D1 = XC7Z045-1FFG900I: as D1 on sheet Z7_POWER1; DatasheetVersion: v1.2; PackageVersion: Rev 1.1; PackageReference: FFG900; PackageDescription: Flip-Chip BGA, Body 31 x 31 mm, 1.0 mm Pitch; Generic Part Number: XC7Z045; RoHS: Pb-Free; Mounting Technology: Surface Mount; Code_JEDEC: MS-034-AAN-1; PartNumber: XC7Z045-1FFG900I; ComponentLink1Description: Datasheet; ComponentLink1URL: http://www.xilinx.com/support/documentation/data_sheets/ds190-Zynq-7000-Overview.pdf; ComponentLink2Description: Package Specification; ComponentLink2URL: http://www.xilinx.com/support/documentation/user_guides/ug865-Zynq-7000-Pkg-Pinout.pdf; ComponentLink3Description: DC and AC Switching Characteristics; ComponentLink3URL: http://www.xilinx.com/support/documentation/data_sheets/ds191-XC7Z030-XC7Z045-data-sheet.pdf; ComponentLink4Description: Package File; ComponentLink4URL: http://www.xilinx.com/support/packagefiles/z7packages/xc7z045ffg900pkg.txt; ComponentLink5Description: Packaging and Pinout; ComponentLink5URL: http://www.xilinx.com/support/documentation/user_guides/ug865-Zynq-7000-Pkg-Pinout.pdf; ComponentLink6Description: PCB and Layout Guide; ComponentLink6URL: http://www.xilinx.com/support/documentation/user_guides/ug483_7Series_PCB.pdf

## Sheet Z7_JTAG&DEBUG.SchDoc
size A3
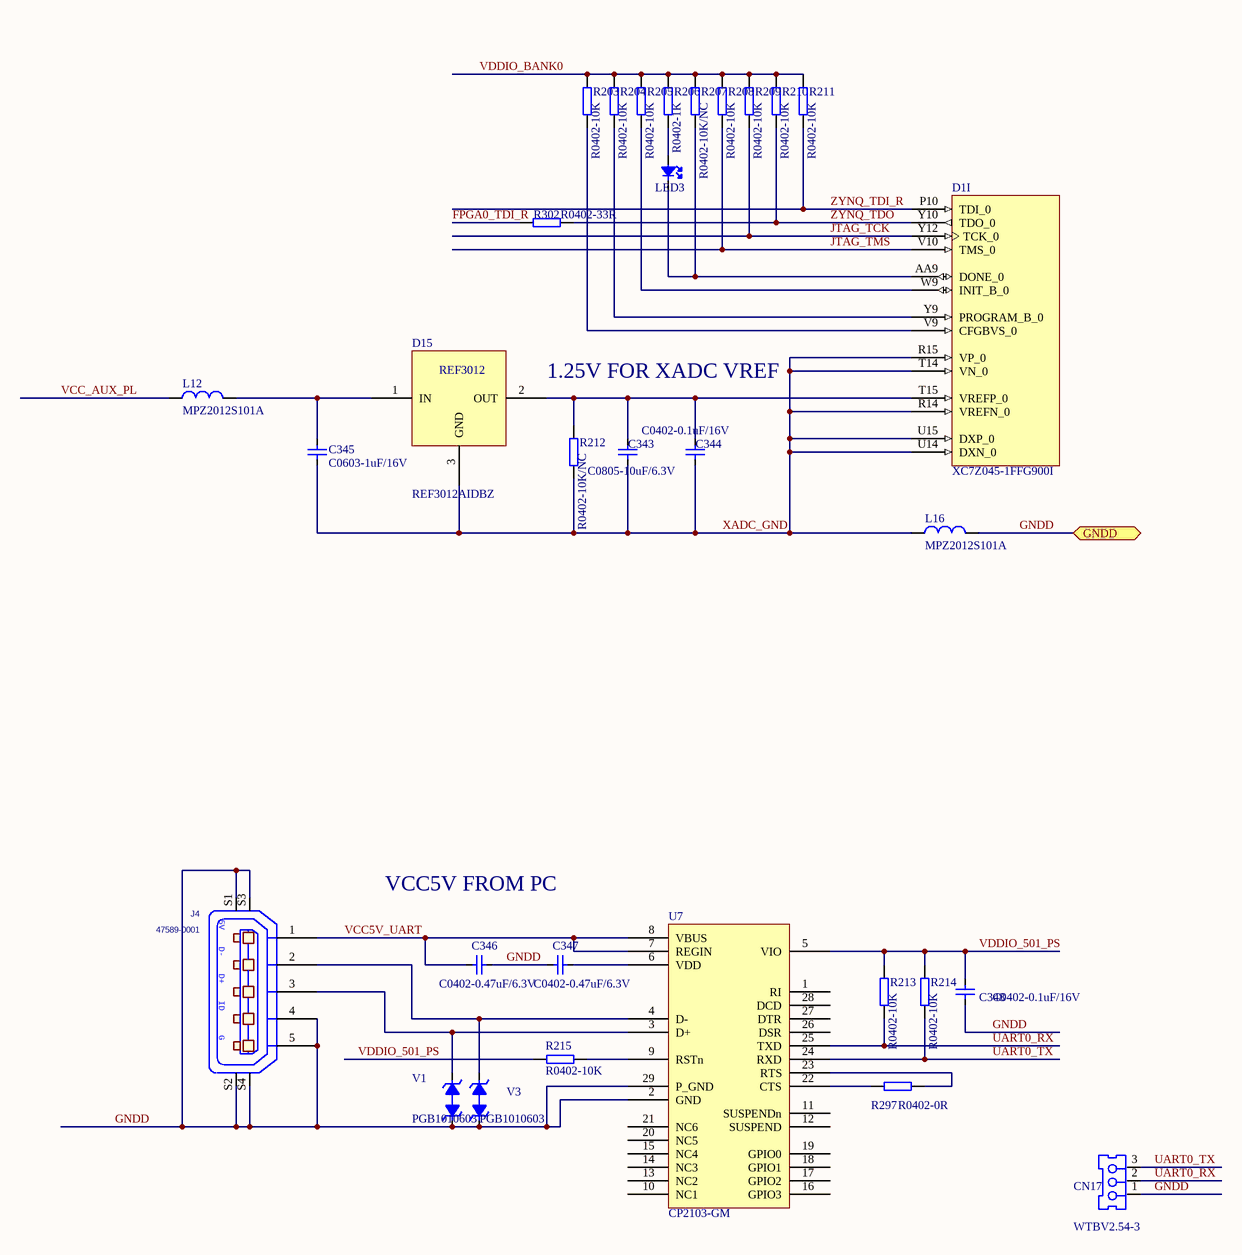
[diagram p25: Z7_JTAG&DEBUG.SchDoc]

### Parts
C343  C0805-10uF/6.3V  [C0805]
C344  C0402-0.1uF/16V  [C0402]
C345  C0603-1uF/16V  [C0603]
C346  C0402-0.47uF/6.3V  [C0402]
C347  C0402-0.47uF/6.3V  [C0402]
C348  C0402-0.1uF/16V  [C0402]
CN17  WTBV2.54-3  [WTB2.54-3V]
D1  XC7Z045-1FFG900I  [FFG900]  (part I of 16)
D15  REF3012AIDBZ  [SOT-23]
J4  47589-0001  [con5_microusb]
L12  MPZ2012S101A  [R0805]
L16  MPZ2012S101A  [R0805]
LED3  LED0603-GREEN  [LED-R0603]  (value not drawn)
R203  R0402-10K  [R0402]
R204  R0402-10K  [R0402]
R205  R0402-10K  [R0402]
R206  R0402-1K  [R0402]
R207  R0402-10K/NC  [R0402]
R208  R0402-10K  [R0402]
R209  R0402-10K  [R0402]
R210  R0402-10K  [R0402]
R211  R0402-10K  [R0402]
R212  R0402-10K/NC  [R0402]
R213  R0402-10K  [R0402]
R214  R0402-10K  [R0402]
R215  R0402-10K  [R0402]
R297  R0402-0R  [R0402]
R302  R0402-33R  [R0402]
U7  CP2103-GM  [QFN-28]
V1  PGB1010603  [R0603]
V3  PGB1010603  [R0603]

### Ports
GNDD

### Nets
GNDD: C346.2 C347.1 C348.2 CN17.1 J4.4(P4) J4.5(P5) J4.S1(SHLD1) J4.S2(SHLD2) J4.S3(SHLD3) J4.S4(SHLD4) L16.2 U7.2(GND) U7.29(P_GND) V1.1(ANODE) V3.1(ANODE) ; port GNDD
VCC_AUX_PL: C348.1 L12.1 R213.1 R214.1 R215.1 U7.5(VIO)  [also labelled VDDIO_501_PS]  [project net VCC1V8]
VDDIO_BANK0: R203.1 R204.1 R205.1 R206.1 R207.1 R208.1 R209.1 R210.1 R211.1  [project net VCC3V3]
FPGA0_TDI_R: R302.1
JTAG_TCK: D1.Y12(TCK_0) R209.2
JTAG_TMS: D1.V10(TMS_0) R208.2
UART0_RX: CN17.2 R213.2 U7.25(TXD)
UART0_TX: CN17.3 R214.2 U7.24(RXD)
VCC5V_UART: C346.1 J4.1(P1) U7.7(REGIN) U7.8(VBUS)
XADC_GND: C343.2 C344.2 C345.2 D1.R14(VREFN_0) D1.R15(VP_0) D1.T14(VN_0) D1.U14(DXN_0) D1.U15(DXP_0) D15.3(GND) L16.1 R212.2
ZYNQ_TDI_R: D1.P10(TDI_0) R211.2
ZYNQ_TDO: D1.Y10(TDO_0) R210.2 R302.2
NetC343_1: C343.1 C344.1 D1.T15(VREFP_0) D15.2(OUT) R212.1
NetC345_1: C345.1 D15.1(IN) L12.2
NetC347_2: C347.2 U7.6(VDD)
NetD1_AA9: D1.AA9(DONE_0) LED3.2(K) R207.2
NetD1_V9: D1.V9(CFGBVS_0) R203.2
NetD1_W9: D1.W9(INIT_B_0) R205.2
NetD1_Y9: D1.Y9(PROGRAM_B_0) R204.2
NetJ4_2: J4.2(P2) U7.4(D-) V3.2(CATHODE)
NetJ4_3: J4.3(P3) U7.3(D+) V1.2(CATHODE)
NetLED3_1: LED3.1(A) R206.2
NetR215_2: R215.2 U7.9(RSTn)
NetR297_1: R297.1 U7.22(CTS)
NetR297_2: R297.2 U7.23(RTS)

Not connected (* = marked no-connect by the designer): U7 1(RI) 10(NC1) 11(SUSPENDn) 12(SUSPEND) 13(NC2) 14(NC3) 15(NC4) 16(GPIO3) 17(GPIO2) 18(GPIO1) 19(GPIO0) 20(NC5) 21(NC6) 26(DSR) 27(DTR) 28(DCD)

### Notes on the sheet
- 1.25V FOR XADC VREF
- VCC5V FROM PC
- (in symbol USB_MINI_AB_RECEPTACLE) 5V; D-; D+; ID; G

### Library data of the parts
C343 = C1210-22uF/16V: Part_number: C0805-10uF/6.3V; Part_type: CAP; Value: C0805-10uF/6.3V; Schematic_Part: CAP; PCB_Footprint: C0805
C344 C346-C348 = C0402-0.1uF/16V: as C351-C357 on sheet Z7_POWER1; Part_type: CAP; temperature: -55℃\+125℃; Schematic_Part: CAP; PCB_Footprint: C0402; datasheet: #DataSheet\C_Samsung_General Capacitors.pdf#
  C344 C348: Part_number: C0402-0.1uF/16V; Value: C0402-0.1uF/16V
  C346 C347: Part_number: C0402-0.47uF/6.3V; Value: C0402-0.47uF/6.3V
C345 = C0603-100nF/16V: X7R; Part_number: C0603-1uF/16V; Part_type: CAP; Value: C0603-1uF/16V; temperature: -55℃\+125℃; Schematic_Part: CAP; PCB_Footprint: C0603
CN17 = WTBV2_0.54-3
D1 = XC7Z045-1FFG900I: as D1 on sheet Z7_POWER1; DatasheetVersion: v1.2; PackageVersion: Rev 1.1; PackageReference: FFG900; PackageDescription: Flip-Chip BGA, Body 31 x 31 mm, 1.0 mm Pitch; Generic Part Number: XC7Z045; RoHS: Pb-Free; Mounting Technology: Surface Mount; Code_JEDEC: MS-034-AAN-1; PartNumber: XC7Z045-1FFG900I; ComponentLink1Description: Datasheet; ComponentLink1URL: http://www.xilinx.com/support/documentation/data_sheets/ds190-Zynq-7000-Overview.pdf; ComponentLink2Description: Package Specification; ComponentLink2URL: http://www.xilinx.com/support/documentation/user_guides/ug865-Zynq-7000-Pkg-Pinout.pdf; ComponentLink3Description: DC and AC Switching Characteristics; ComponentLink3URL: http://www.xilinx.com/support/documentation/data_sheets/ds191-XC7Z030-XC7Z045-data-sheet.pdf; ComponentLink4Description: Package File; ComponentLink4URL: http://www.xilinx.com/support/packagefiles/z7packages/xc7z045ffg900pkg.txt; ComponentLink5Description: Packaging and Pinout; ComponentLink5URL: http://www.xilinx.com/support/documentation/user_guides/ug865-Zynq-7000-Pkg-Pinout.pdf; ComponentLink6Description: PCB and Layout Guide; ComponentLink6URL: http://www.xilinx.com/support/documentation/user_guides/ug483_7Series_PCB.pdf
J4 = USB_MINI_AB_RECEPTACLE: MOLEX MICRO USB AB 5; CLASS: IO; FPLIST: con5_microusb,con5_microusb_cust; CAD_APPROVED: Yes; DESCRIPTION: CON 1X5 USB_MICRO_AB_RECEPTACLE RA SMT 0.65MM SP 105H AU; AGILE_PN: 211-78722; HEIGHT: 2.65MM; ROHS: Yes; MFG_PN01: 47589-0001; MFG_NAME01: Molex
L12 L16 = FB0805-330R@100MHz: Manufacturer: TDK; Part_number: MPZ2012S101A; Part_type: BEAD; temperature: -55℃\+125℃; Value1: 330R@100MHz; Schematic_Part: BEAD; PCB_Footprint: R0805; Manufacturer_p/n: MPZ2012S101A
LED3 = LED-R_3: 表贴发光二极管, 0603封装, 体积1.6x0.8mm, 绿色, 高度0.8mm; Part_number: LED0603-GREEN
R203-R215 R297 R302 = R0402-10K: Manufacturer: SAMSUNG; Part_type: RES; Schematic_Part: RES; PCB_Footprint: R0402
  R203-R205 R208-R211 R213-R215: Part_number: R0402-10K; Value: R0402-10K
  R206: Part_number: R0402-1K; Value: R0402-1K
  R207 R212: Part_number: R0402-10K/NC; Value: R0402-10K/NC
  R297: Part_number: R0402-0R; Value: R0402-0R
  R302: Part_number: R0402-33R; Value: R0402-33R
U7 = CP2103: Part_number: CP2103-GM
V1 V3 = PGB1010603: U_Protector_PGB1 Series Lead-Free 0603 Surface Mount ESD Suppressor_PGB1010603_SMT_SOCM-1608_L1.6×W0.78×H0.35mm; Manufacturer: Littelfuse; Designer: WHG; Manufacturer Part Number: PGB1010603; Design Date: 2016.3.24; Value: PGB1010603
D15 = REF3012AIDBZ: Part_number: REF3012AIDBZ

## Sheet Z7_USB.SchDoc
size A3
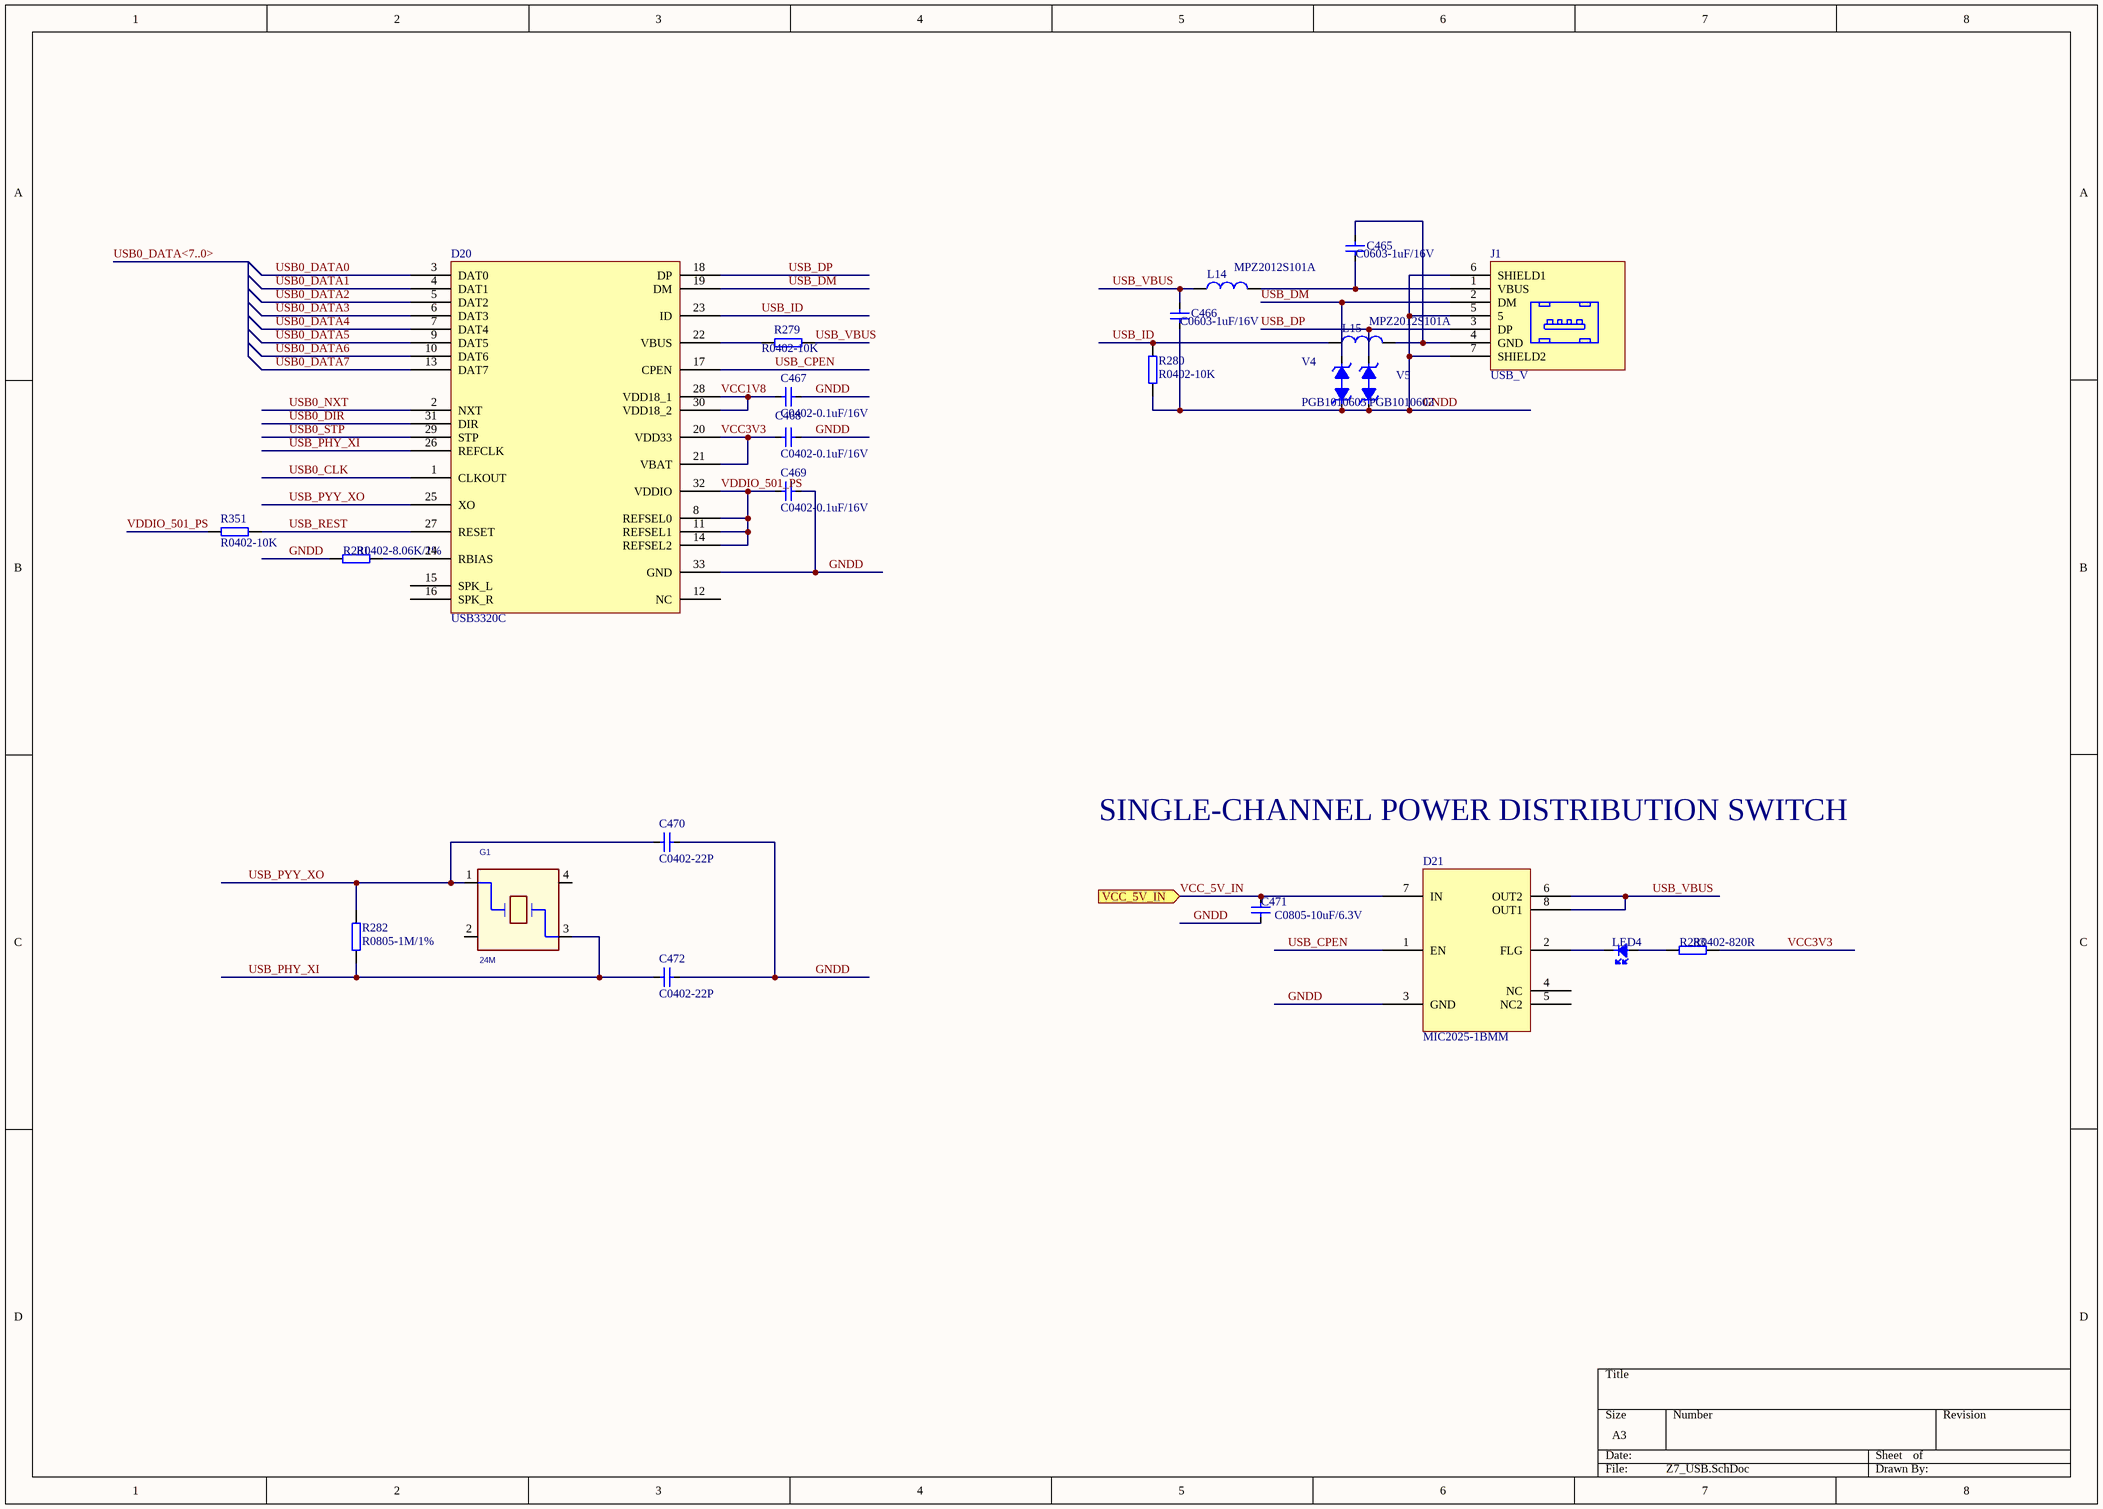
[diagram p26: Z7_USB.SchDoc]

### Parts
C465  C0603-1uF/16V  [C0603]
C466  C0603-1uF/16V  [C0603]
C467  C0402-0.1uF/16V  [C0402]
C468  C0402-0.1uF/16V  [C0402]
C469  C0402-0.1uF/16V  [C0402]
C470  C0402-22P  [C0402]
C471  C0805-10uF/6.3V  [C0805]
C472  C0402-22P  [C0402]
D20  USB3320C  [QFN-32N]
D21  MIC2025-1BMM  [RM-8]
G1  24M  [OSC3225-4P]
J1  USB_V  [USB_TYPEA]
L14  MPZ2012S101A  [R0805]
L15  MPZ2012S101A  [R0805]
LED4  LED0603-GREEN  [LED-R0603]  (value not drawn)
R279  R0402-10K  [R0402]
R280  R0402-10K  [R0402]
R281  R0402-8.06K/1%  [R0402]
R282  R0805-1M/1%  [R0805]
R283  R0402-820R  [R0402]
R351  R0402-10K  [R0402]
V4  PGB1010603  [R0603]
V5  PGB1010603  [R0603]

### Ports
VCC_5V_IN (in)

### Nets
GNDD: C466.2 C467.2 C468.2 C469.2 C470.2 C471.2 C472.2 D20.33(GND) D21.3(GND) J1.5 J1.6(SHIELD1) J1.7(SHIELD2) R280.1 R281.1 V4.1(ANODE) V5.1(ANODE)
VCC1V8: C467.1 C469.1 D20.8(REFSEL0) D20.11(REFSEL1) D20.14(REFSEL2) D20.28(VDD18_1) D20.30(VDD18_2) D20.32(VDDIO) R351.2  [also labelled VDDIO_501_PS]
VCC3V3: C468.1 D20.20(VDD33) D20.21(VBAT) R283.2
USB0_CLK: D20.1(CLKOUT)
USB0_DATA0: D20.3(DAT0)
USB0_DATA1: D20.4(DAT1)
USB0_DATA2: D20.5(DAT2)
USB0_DATA3: D20.6(DAT3)
USB0_DATA4: D20.7(DAT4)
USB0_DATA5: D20.9(DAT5)
USB0_DATA6: D20.10(DAT6)
USB0_DATA7: D20.13(DAT7)
USB0_DIR: D20.31(DIR)
USB0_NXT: D20.2(NXT)
USB0_STP: D20.29(STP)
USB_CPEN: D20.17(CPEN) D21.1(EN)
USB_DM: D20.19(DM) J1.2(DM) V4.2(CATHODE)
USB_DP: D20.18(DP) J1.3(DP) V5.2(CATHODE)
USB_ID: D20.23(ID) L15.1 R280.2
USB_PHY_XI: C472.1 D20.26(REFCLK) G1.3 R282.1
USB_PYY_XO: C470.1 D20.25(XO) G1.1 R282.2
USB_REST: D20.27(RESET) R351.1
USB_VBUS: C466.1 D21.6(OUT2) D21.8(OUT1) L14.1 R279.2
VCC_5V_IN: C471.1 D21.7(IN) ; port VCC_5V_IN
NetC465_1: C465.1 J1.4(GND) L15.2
NetC465_2: C465.2 J1.1(VBUS) L14.2
NetD20_22: D20.22(VBUS) R279.1
NetD20_24: D20.24(RBIAS) R281.2
NetD21_2: D21.2(FLG) LED4.2(K)
NetLED4_1: LED4.1(A) R283.1

Not connected (* = marked no-connect by the designer): D20 12(NC) 15(SPK_L) 16(SPK_R); D21 4(NC) 5(NC2); G1 2 4

### Buses and harness runs
bus USB0_DATA<7..0>

### Notes on the sheet
- SINGLE-CHANNEL POWER DISTRIBUTION SWITCH

### Library data of the parts
C465 C466 = C0603-100nF/16V: X7R; Part_number: C0603-1uF/16V; Part_type: CAP; Value: C0603-1uF/16V; temperature: -55℃\+125℃; Schematic_Part: CAP; PCB_Footprint: C0603
C467-C470 C472 = C0402-0.1uF/16V: as C351-C357 on sheet Z7_POWER1; Part_type: CAP; temperature: -55℃\+125℃; Schematic_Part: CAP; PCB_Footprint: C0402; datasheet: #DataSheet\C_Samsung_General Capacitors.pdf#
  C467-C469: Part_number: C0402-0.1uF/16V; Value: C0402-0.1uF/16V
  C470 C472: Part_number: C0402-22P; Value: C0402-22P
C471 = C1210-22uF/16V: Part_number: C0805-10uF/6.3V; Part_type: CAP; Value: C0805-10uF/6.3V; Schematic_Part: CAP; PCB_Footprint: C0805
G1 = XTAL_13Y: XTAL 25MHZ -- -- SMT; CLASS: IC; CAD_APPROVED: Yes; MFG_PN01: ABMM-25.000MHZ-B2-T; MFG_NAME01: ABRACON CORP; AGILE_PN: 230-77853; HEIGHT: 1.3MM; ROHS: Yes
J1 = USB_OTG_VBUS: Part_number: USB_V
L14 L15 = FB0805-330R@100MHz: Manufacturer: TDK; Part_number: MPZ2012S101A; Part_type: BEAD; temperature: -55℃\+125℃; Value1: 330R@100MHz; Schematic_Part: BEAD; PCB_Footprint: R0805; Manufacturer_p/n: MPZ2012S101A
LED4 = LED-R_3: as LED3 on sheet Z7_JTAG&DEBUG; Part_number: LED0603-GREEN
R279-R281 R283 R351 = R0402-10K: Manufacturer: SAMSUNG; Part_type: RES; Schematic_Part: RES; PCB_Footprint: R0402
  R279 R280 R351: Part_number: R0402-10K; Value: R0402-10K
  R281: Part_number: R0402-8.06K/1%; Value: R0402-8.06K/1%
  R283: Part_number: R0402-820R; Value: R0402-820R
R282 = R0805-1M/1%: Manufacturer: SAMSUNG; Part_number: R0805-1M/1%; Part_type: RES; Value: R0805-1M/1%; Schematic_Part: RES; PCB_Footprint: R0805
V4 V5 = PGB1010603: as V1 on sheet Z7_JTAG&DEBUG; Manufacturer Part Number: PGB1010603; Design Date: 2016.3.24; Value: PGB1010603
D21 = MIC2025-1BMM: Part_number: MIC2025-1BMM

## Sheet Z7_BANK_DDR3.SchDoc
size A3
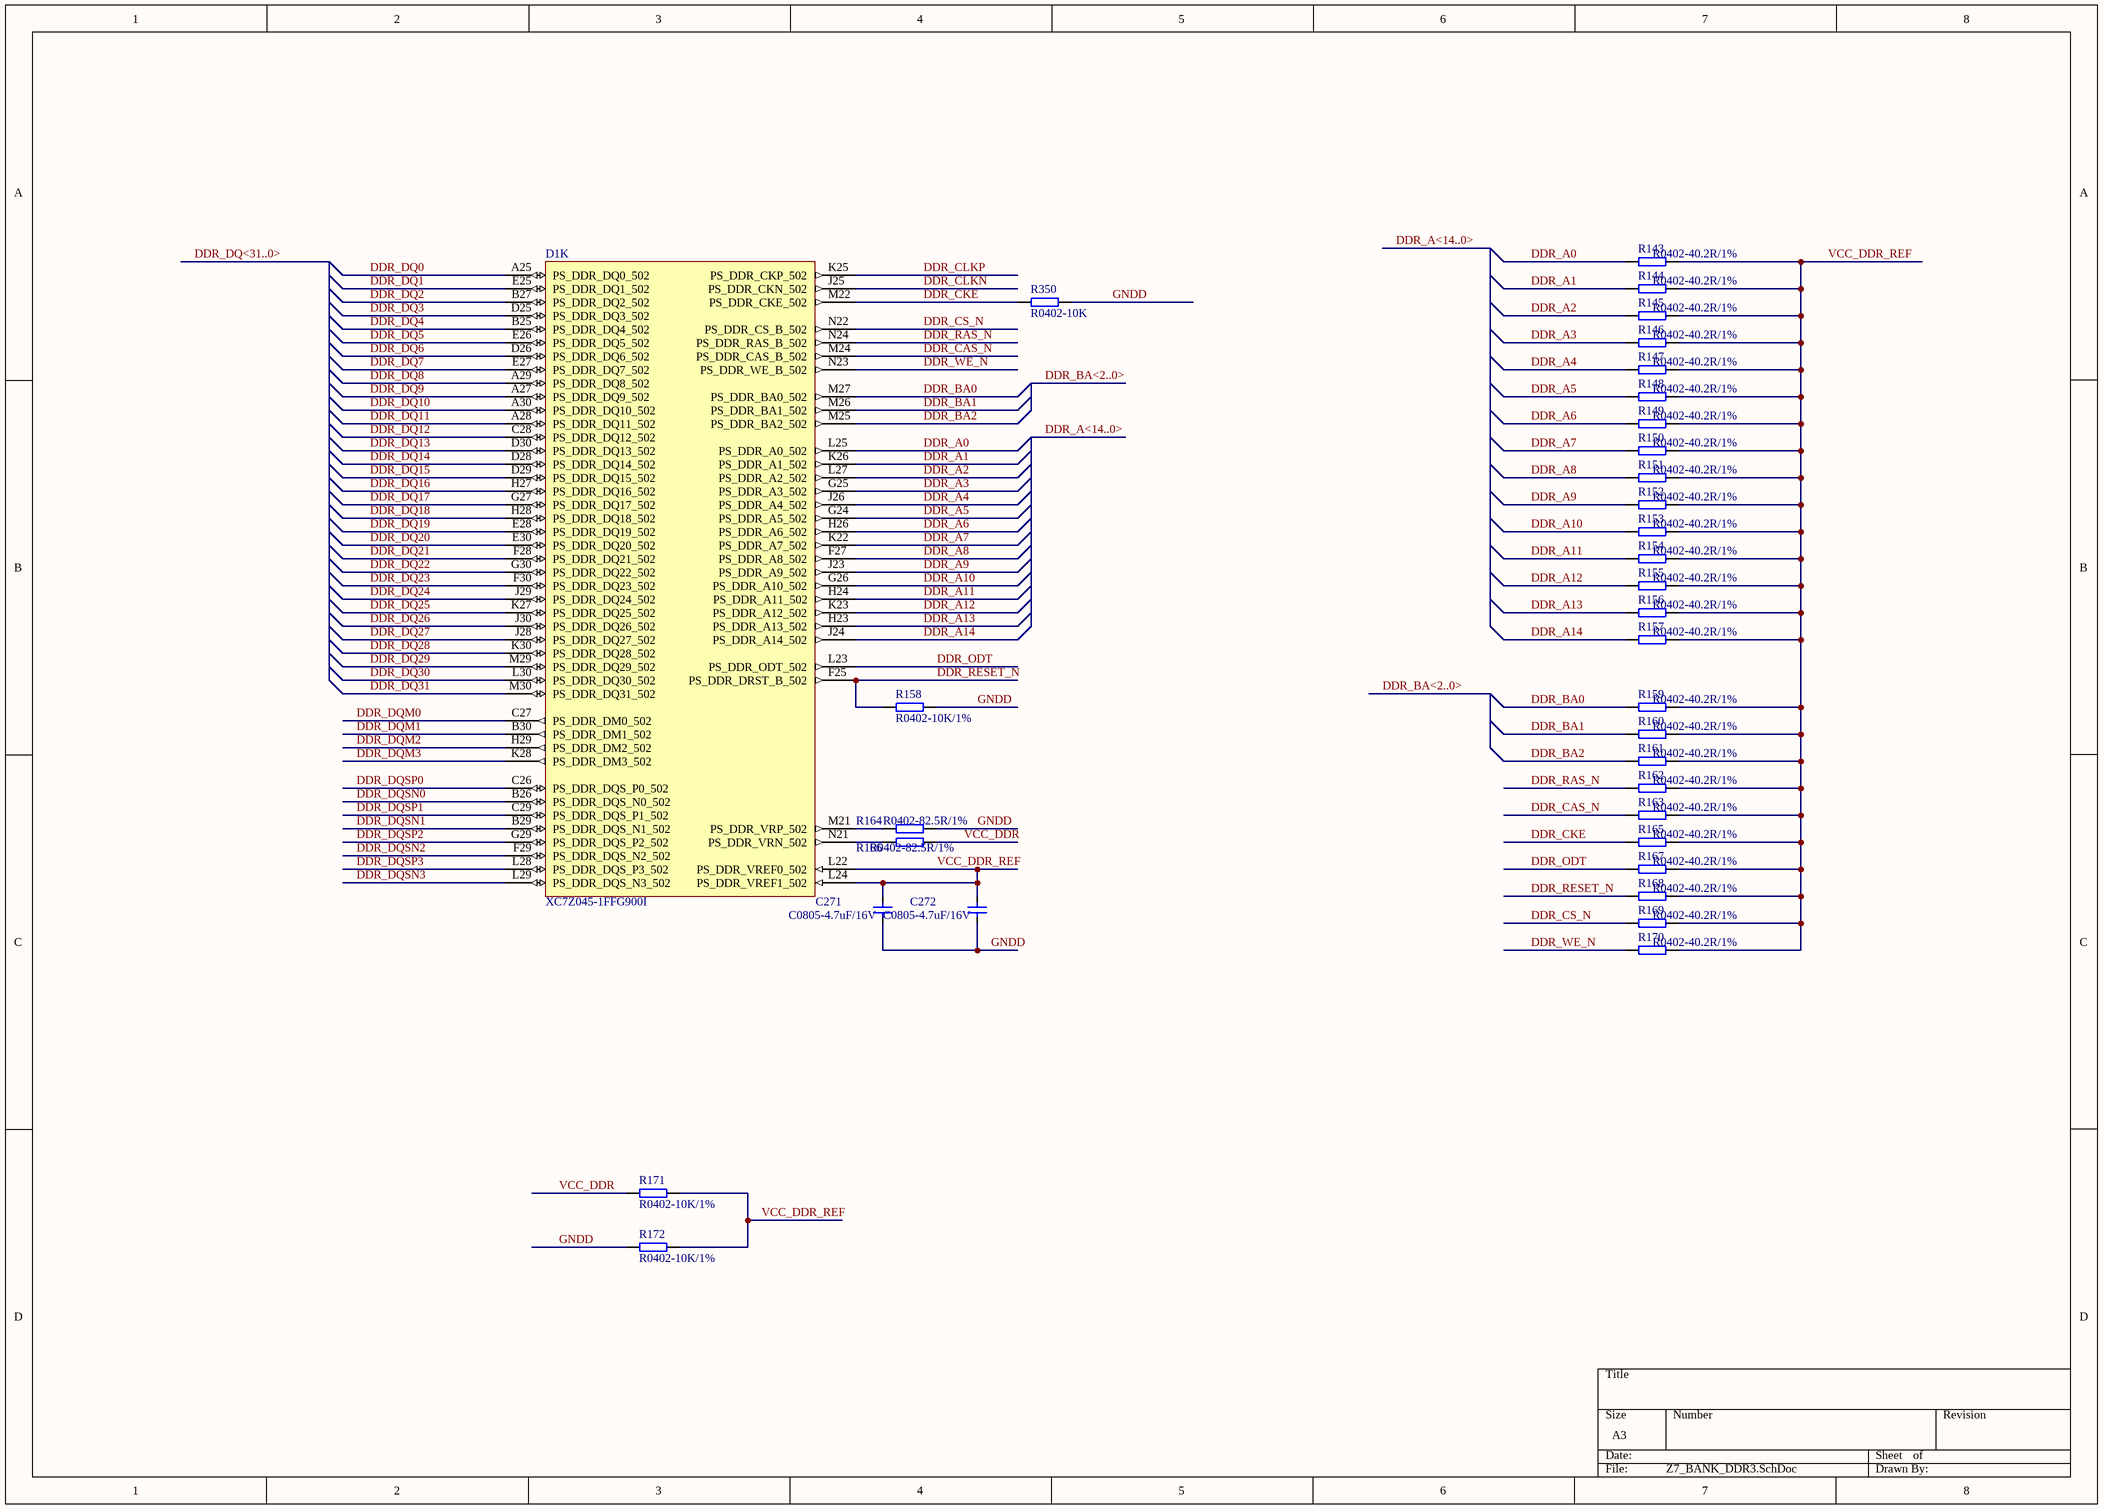
[diagram p27: Z7_BANK_DDR3.SchDoc]

### Parts
C271  C0805-4.7uF/16V  [C0805]
C272  C0805-4.7uF/16V  [C0805]
D1  XC7Z045-1FFG900I  [FFG900]  (part K of 16)
R143  R0402-40.2R/1%  [R0402]
R144  R0402-40.2R/1%  [R0402]
R145  R0402-40.2R/1%  [R0402]
R146  R0402-40.2R/1%  [R0402]
R147  R0402-40.2R/1%  [R0402]
R148  R0402-40.2R/1%  [R0402]
R149  R0402-40.2R/1%  [R0402]
R150  R0402-40.2R/1%  [R0402]
R151  R0402-40.2R/1%  [R0402]
R152  R0402-40.2R/1%  [R0402]
R153  R0402-40.2R/1%  [R0402]
R154  R0402-40.2R/1%  [R0402]
R155  R0402-40.2R/1%  [R0402]
R156  R0402-40.2R/1%  [R0402]
R157  R0402-40.2R/1%  [R0402]
R158  R0402-10K/1%  [R0402]
R159  R0402-40.2R/1%  [R0402]
R160  R0402-40.2R/1%  [R0402]
R161  R0402-40.2R/1%  [R0402]
R162  R0402-40.2R/1%  [R0402]
R163  R0402-40.2R/1%  [R0402]
R164  R0402-82.5R/1%  [R0402]
R165  R0402-40.2R/1%  [R0402]
R166  R0402-82.5R/1%  [R0402]
R167  R0402-40.2R/1%  [R0402]
R168  R0402-40.2R/1%  [R0402]
R169  R0402-40.2R/1%  [R0402]
R170  R0402-40.2R/1%  [R0402]
R171  R0402-10K/1%  [R0402]
R172  R0402-10K/1%  [R0402]
R350  R0402-10K  [R0402]

### Nets
GNDD: C271.2 C272.2 R158.1 R164.1 R172.2 R350.1
VCC_DDR: R166.1 R171.2  [project net VCC1V35]
DDR_A0: D1.L25(PS_DDR_A0_502) R143.1
DDR_A1: D1.K26(PS_DDR_A1_502) R144.1
DDR_A2: D1.L27(PS_DDR_A2_502) R145.1
DDR_A3: D1.G25(PS_DDR_A3_502) R146.1
DDR_A4: D1.J26(PS_DDR_A4_502) R147.1
DDR_A5: D1.G24(PS_DDR_A5_502) R148.1
DDR_A6: D1.H26(PS_DDR_A6_502) R149.1
DDR_A7: D1.K22(PS_DDR_A7_502) R150.1
DDR_A8: D1.F27(PS_DDR_A8_502) R151.1
DDR_A9: D1.J23(PS_DDR_A9_502) R152.1
DDR_A10: D1.G26(PS_DDR_A10_502) R153.1
DDR_A11: D1.H24(PS_DDR_A11_502) R154.1
DDR_A12: D1.K23(PS_DDR_A12_502) R155.1
DDR_A13: D1.H23(PS_DDR_A13_502) R156.1
DDR_A14: D1.J24(PS_DDR_A14_502) R157.1
DDR_BA0: D1.M27(PS_DDR_BA0_502) R159.1
DDR_BA1: D1.M26(PS_DDR_BA1_502) R160.1
DDR_BA2: D1.M25(PS_DDR_BA2_502) R161.1
DDR_CAS_N: D1.M24(PS_DDR_CAS_B_502) R163.1
DDR_CKE: D1.M22(PS_DDR_CKE_502) R165.1 R350.2
DDR_CLKN: D1.J25(PS_DDR_CKN_502)
DDR_CLKP: D1.K25(PS_DDR_CKP_502)
DDR_CS_N: D1.N22(PS_DDR_CS_B_502) R169.1
DDR_DQ0: D1.A25(PS_DDR_DQ0_502)
DDR_DQ1: D1.E25(PS_DDR_DQ1_502)
DDR_DQ2: D1.B27(PS_DDR_DQ2_502)
DDR_DQ3: D1.D25(PS_DDR_DQ3_502)
DDR_DQ4: D1.B25(PS_DDR_DQ4_502)
DDR_DQ5: D1.E26(PS_DDR_DQ5_502)
DDR_DQ6: D1.D26(PS_DDR_DQ6_502)
DDR_DQ7: D1.E27(PS_DDR_DQ7_502)
DDR_DQ8: D1.A29(PS_DDR_DQ8_502)
DDR_DQ9: D1.A27(PS_DDR_DQ9_502)
DDR_DQ10: D1.A30(PS_DDR_DQ10_502)
DDR_DQ11: D1.A28(PS_DDR_DQ11_502)
DDR_DQ12: D1.C28(PS_DDR_DQ12_502)
DDR_DQ13: D1.D30(PS_DDR_DQ13_502)
DDR_DQ14: D1.D28(PS_DDR_DQ14_502)
DDR_DQ15: D1.D29(PS_DDR_DQ15_502)
DDR_DQ16: D1.H27(PS_DDR_DQ16_502)
DDR_DQ17: D1.G27(PS_DDR_DQ17_502)
DDR_DQ18: D1.H28(PS_DDR_DQ18_502)
DDR_DQ19: D1.E28(PS_DDR_DQ19_502)
DDR_DQ20: D1.E30(PS_DDR_DQ20_502)
DDR_DQ21: D1.F28(PS_DDR_DQ21_502)
DDR_DQ22: D1.G30(PS_DDR_DQ22_502)
DDR_DQ23: D1.F30(PS_DDR_DQ23_502)
DDR_DQ24: D1.J29(PS_DDR_DQ24_502)
DDR_DQ25: D1.K27(PS_DDR_DQ25_502)
DDR_DQ26: D1.J30(PS_DDR_DQ26_502)
DDR_DQ27: D1.J28(PS_DDR_DQ27_502)
DDR_DQ28: D1.K30(PS_DDR_DQ28_502)
DDR_DQ29: D1.M29(PS_DDR_DQ29_502)
DDR_DQ30: D1.L30(PS_DDR_DQ30_502)
DDR_DQ31: D1.M30(PS_DDR_DQ31_502)
DDR_DQM0: D1.C27(PS_DDR_DM0_502)
DDR_DQM1: D1.B30(PS_DDR_DM1_502)
DDR_DQM2: D1.H29(PS_DDR_DM2_502)
DDR_DQM3: D1.K28(PS_DDR_DM3_502)
DDR_DQSN0: D1.B26(PS_DDR_DQS_N0_502)
DDR_DQSN1: D1.B29(PS_DDR_DQS_N1_502)
DDR_DQSN2: D1.F29(PS_DDR_DQS_N2_502)
DDR_DQSN3: D1.L29(PS_DDR_DQS_N3_502)
DDR_DQSP0: D1.C26(PS_DDR_DQS_P0_502)
DDR_DQSP1: D1.C29(PS_DDR_DQS_P1_502)
DDR_DQSP2: D1.G29(PS_DDR_DQS_P2_502)
DDR_DQSP3: D1.L28(PS_DDR_DQS_P3_502)
DDR_ODT: D1.L23(PS_DDR_ODT_502) R167.1
DDR_RAS_N: D1.N24(PS_DDR_RAS_B_502) R162.1
DDR_RESET_N: D1.F25(PS_DDR_DRST_B_502) R158.2 R168.1
DDR_WE_N: D1.N23(PS_DDR_WE_B_502) R170.1
VCC_DDR_REF: C271.1 C272.1 D1.L22(PS_DDR_VREF0_502) D1.L24(PS_DDR_VREF1_502) R143.2 R144.2 R145.2 R146.2 R147.2 R148.2 R149.2 R150.2 R151.2 R152.2 R153.2 R154.2 R155.2 R156.2 R157.2 R159.2 R160.2 R161.2 R162.2 R163.2 R165.2 R167.2 R168.2 R169.2 R170.2 R171.1 R172.1
NetD1_M21: D1.M21(PS_DDR_VRP_502) R164.2
NetD1_N21: D1.N21(PS_DDR_VRN_502) R166.2

### Buses and harness runs
bus DDR_A<14..0>
bus DDR_BA<2..0>
bus DDR_DQ<31..0>

### Library data of the parts
C271 C272 = C0805-4.7uF/50V: X7R; Manufacturer: SAMSUNG; Part_number: C0805-4.7uF/16V; Part_type: CAP; Value: C0805-4.7uF/16V; Schematic_Part: CAP; PCB_Footprint: C0805; datasheet: #DataSheet\C_Samsung_General Capacitors.pdf#
D1 = XC7Z045-1FFG900I: as D1 on sheet Z7_POWER1; DatasheetVersion: v1.2; PackageVersion: Rev 1.1; PackageReference: FFG900; PackageDescription: Flip-Chip BGA, Body 31 x 31 mm, 1.0 mm Pitch; Generic Part Number: XC7Z045; RoHS: Pb-Free; Mounting Technology: Surface Mount; Code_JEDEC: MS-034-AAN-1; PartNumber: XC7Z045-1FFG900I; ComponentLink1Description: Datasheet; ComponentLink1URL: http://www.xilinx.com/support/documentation/data_sheets/ds190-Zynq-7000-Overview.pdf; ComponentLink2Description: Package Specification; ComponentLink2URL: http://www.xilinx.com/support/documentation/user_guides/ug865-Zynq-7000-Pkg-Pinout.pdf; ComponentLink3Description: DC and AC Switching Characteristics; ComponentLink3URL: http://www.xilinx.com/support/documentation/data_sheets/ds191-XC7Z030-XC7Z045-data-sheet.pdf; ComponentLink4Description: Package File; ComponentLink4URL: http://www.xilinx.com/support/packagefiles/z7packages/xc7z045ffg900pkg.txt; ComponentLink5Description: Packaging and Pinout; ComponentLink5URL: http://www.xilinx.com/support/documentation/user_guides/ug865-Zynq-7000-Pkg-Pinout.pdf; ComponentLink6Description: PCB and Layout Guide; ComponentLink6URL: http://www.xilinx.com/support/documentation/user_guides/ug483_7Series_PCB.pdf
R143-R157 R159-R163 R165 R167-R170 = R0603-40.2R/1%: Manufacturer: SAMSUNG; PCB_Footprint: R0603; Part_number: R0402-40.2R/1%; Part_type: RES; Value: R0402-40.2R/1%; Schematic_Part: RES
R158 R164 R166 R171 R172 R350 = R0402-10K: Manufacturer: SAMSUNG; Part_type: RES; Schematic_Part: RES; PCB_Footprint: R0402
  R158 R171 R172: Part_number: R0402-10K/1%; Value: R0402-10K/1%
  R164 R166: Part_number: R0402-82.5R/1%; Value: R0402-82.5R/1%
  R350: Part_number: R0402-10K; Value: R0402-10K

## Sheet Z7_DDR3.SchDoc
size A3
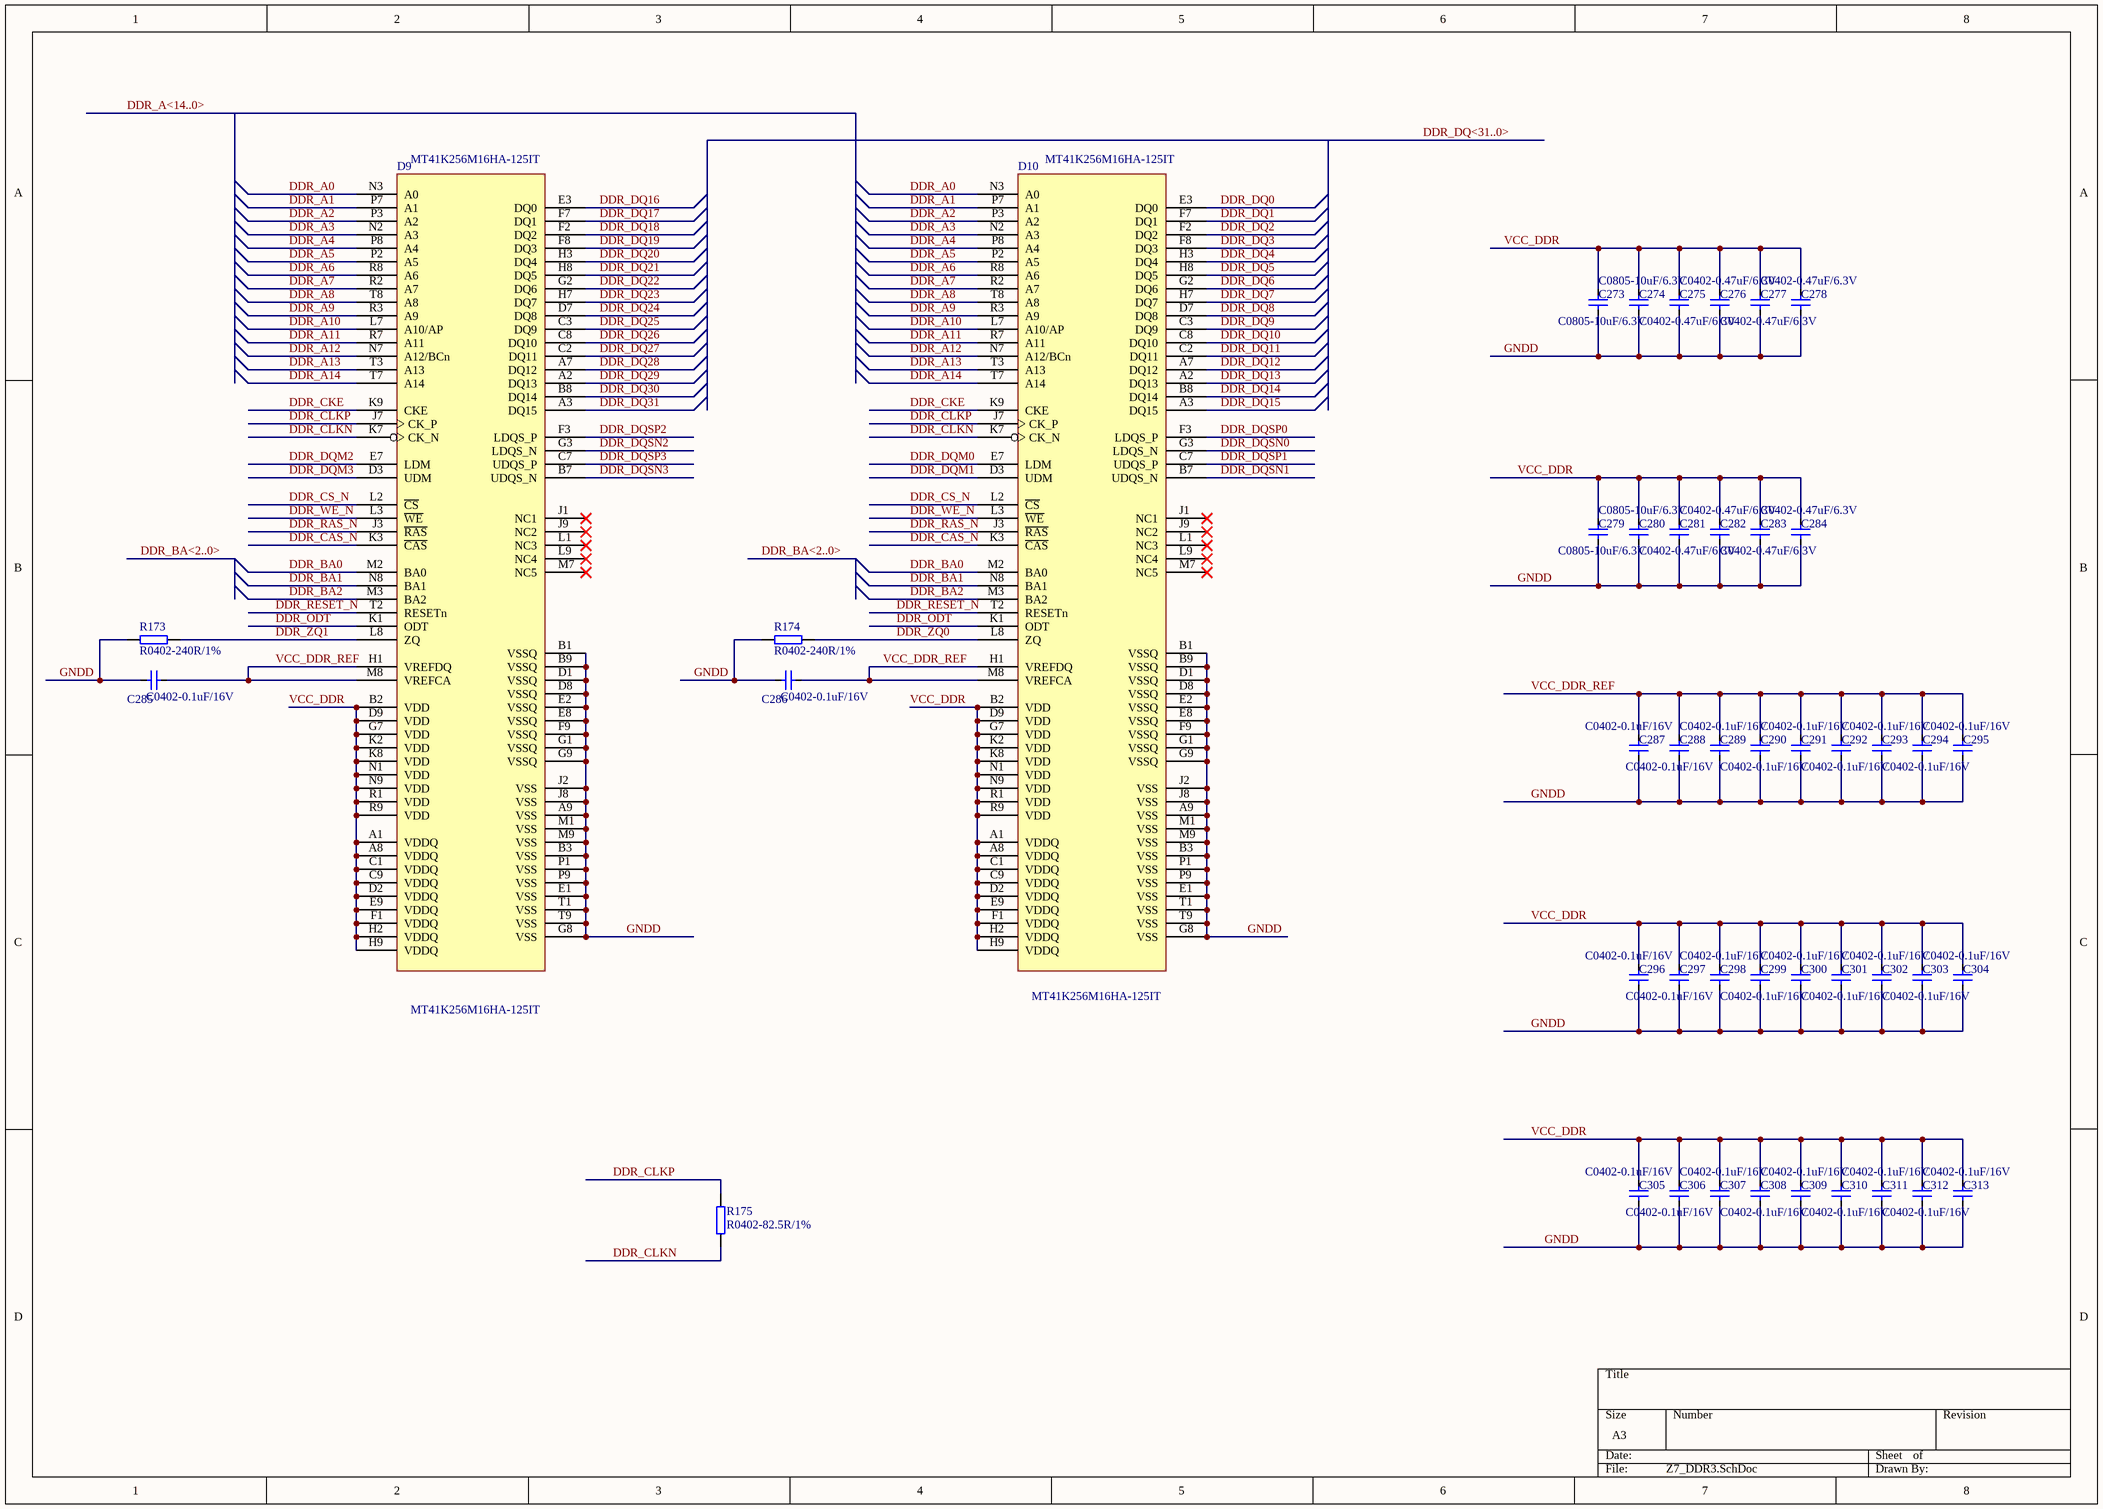
[diagram p28: Z7_DDR3.SchDoc]

### Parts
C273  C0805-10uF/6.3V  [C0805]
C274  C0805-10uF/6.3V  [C0805]
C275  C0402-0.47uF/6.3V  [C0402]
C276  C0402-0.47uF/6.3V  [C0402]
C277  C0402-0.47uF/6.3V  [C0402]
C278  C0402-0.47uF/6.3V  [C0402]
C279  C0805-10uF/6.3V  [C0805]
C280  C0805-10uF/6.3V  [C0805]
C281  C0402-0.47uF/6.3V  [C0402]
C282  C0402-0.47uF/6.3V  [C0402]
C283  C0402-0.47uF/6.3V  [C0402]
C284  C0402-0.47uF/6.3V  [C0402]
C285  C0402-0.1uF/16V  [C0402]
C286  C0402-0.1uF/16V  [C0402]
C287  C0402-0.1uF/16V  [C0402]
C288  C0402-0.1uF/16V  [C0402]
C289  C0402-0.1uF/16V  [C0402]
C290  C0402-0.1uF/16V  [C0402]
C291  C0402-0.1uF/16V  [C0402]
C292  C0402-0.1uF/16V  [C0402]
C293  C0402-0.1uF/16V  [C0402]
C294  C0402-0.1uF/16V  [C0402]
C295  C0402-0.1uF/16V  [C0402]
C296  C0402-0.1uF/16V  [C0402]
C297  C0402-0.1uF/16V  [C0402]
C298  C0402-0.1uF/16V  [C0402]
C299  C0402-0.1uF/16V  [C0402]
C300  C0402-0.1uF/16V  [C0402]
C301  C0402-0.1uF/16V  [C0402]
C302  C0402-0.1uF/16V  [C0402]
C303  C0402-0.1uF/16V  [C0402]
C304  C0402-0.1uF/16V  [C0402]
C305  C0402-0.1uF/16V  [C0402]
C306  C0402-0.1uF/16V  [C0402]
C307  C0402-0.1uF/16V  [C0402]
C308  C0402-0.1uF/16V  [C0402]
C309  C0402-0.1uF/16V  [C0402]
C310  C0402-0.1uF/16V  [C0402]
C311  C0402-0.1uF/16V  [C0402]
C312  C0402-0.1uF/16V  [C0402]
C313  C0402-0.1uF/16V  [C0402]
D9  MT41K256M16HA-125IT  [BGA96C80P16X9_1400X900X120]
D10  MT41K256M16HA-125IT  [BGA96C80P16X9_1400X900X120]
R173  R0402-240R/1%  [R0402]
R174  R0402-240R/1%  [R0402]
R175  R0402-82.5R/1%  [R0402]

### Nets
GNDD: C273.2 C274.2 C275.2 C276.2 C277.2 C278.2 C279.2 C280.2 C281.2 C282.2 C283.2 C284.2 C285.1 C286.1 C287.2 C288.2 C289.2 C290.2 C291.2 C292.2 C293.2 C294.2 C295.2 C296.2 C297.2 C298.2 C299.2 C300.2 C301.2 C302.2 C303.2 C304.2 C305.2 C306.2 C307.2 C308.2 C309.2 C310.2 C311.2 C312.2 C313.2 D9.A9(VSS) D9.B1(VSSQ) D9.B3(VSS) D9.B9(VSSQ) D9.D1(VSSQ) D9.D8(VSSQ) D9.E1(VSS) D9.E2(VSSQ) D9.E8(VSSQ) D9.F9(VSSQ) D9.G1(VSSQ) D9.G8(VSS) D9.G9(VSSQ) D9.J2(VSS) D9.J8(VSS) D9.M1(VSS) D9.M9(VSS) D9.P1(VSS) D9.P9(VSS) D9.T1(VSS) D9.T9(VSS) D10.A9(VSS) D10.B1(VSSQ) D10.B3(VSS) D10.B9(VSSQ) D10.D1(VSSQ) D10.D8(VSSQ) D10.E1(VSS) D10.E2(VSSQ) D10.E8(VSSQ) D10.F9(VSSQ) D10.G1(VSSQ) D10.G8(VSS) D10.G9(VSSQ) D10.J2(VSS) D10.J8(VSS) D10.M1(VSS) D10.M9(VSS) D10.P1(VSS) D10.P9(VSS) D10.T1(VSS) D10.T9(VSS) R173.2 R174.2
VCC_DDR: C273.1 C274.1 C275.1 C276.1 C277.1 C278.1 C279.1 C280.1 C281.1 C282.1 C283.1 C284.1 C296.1 C297.1 C298.1 C299.1 C300.1 C301.1 C302.1 C303.1 C304.1 C305.1 C306.1 C307.1 C308.1 C309.1 C310.1 C311.1 C312.1 C313.1 D9.A1(VDDQ) D9.A8(VDDQ) D9.B2(VDD) D9.C1(VDDQ) D9.C9(VDDQ) D9.D2(VDDQ) D9.D9(VDD) D9.E9(VDDQ) D9.F1(VDDQ) D9.G7(VDD) D9.H2(VDDQ) D9.H9(VDDQ) D9.K2(VDD) D9.K8(VDD) D9.N1(VDD) D9.N9(VDD) D9.R1(VDD) D9.R9(VDD) D10.A1(VDDQ) D10.A8(VDDQ) D10.B2(VDD) D10.C1(VDDQ) D10.C9(VDDQ) D10.D2(VDDQ) D10.D9(VDD) D10.E9(VDDQ) D10.F1(VDDQ) D10.G7(VDD) D10.H2(VDDQ) D10.H9(VDDQ) D10.K2(VDD) D10.K8(VDD) D10.N1(VDD) D10.N9(VDD) D10.R1(VDD) D10.R9(VDD)  [project net VCC1V35]
DDR_A0: D9.N3(A0) D10.N3(A0)
DDR_A1: D9.P7(A1) D10.P7(A1)
DDR_A2: D9.P3(A2) D10.P3(A2)
DDR_A3: D9.N2(A3) D10.N2(A3)
DDR_A4: D9.P8(A4) D10.P8(A4)
DDR_A5: D9.P2(A5) D10.P2(A5)
DDR_A6: D9.R8(A6) D10.R8(A6)
DDR_A7: D9.R2(A7) D10.R2(A7)
DDR_A8: D9.T8(A8) D10.T8(A8)
DDR_A9: D9.R3(A9) D10.R3(A9)
DDR_A10: D9.L7(A10/AP) D10.L7(A10/AP)
DDR_A11: D9.R7(A11) D10.R7(A11)
DDR_A12: D9.N7(A12/BCn) D10.N7(A12/BCn)
DDR_A13: D9.T3(A13) D10.T3(A13)
DDR_A14: D9.T7(A14) D10.T7(A14)
DDR_BA0: D9.M2(BA0) D10.M2(BA0)
DDR_BA1: D9.N8(BA1) D10.N8(BA1)
DDR_BA2: D9.M3(BA2) D10.M3(BA2)
DDR_CAS_N: D9.K3(~{CAS}) D10.K3(~{CAS})
DDR_CKE: D9.K9(CKE) D10.K9(CKE)
DDR_CLKN: D9.K7(CK_N) D10.K7(CK_N) R175.1
DDR_CLKP: D9.J7(CK_P) D10.J7(CK_P) R175.2
DDR_CS_N: D9.L2(~{CS}) D10.L2(~{CS})
DDR_DQ0: D10.E3(DQ0)
DDR_DQ1: D10.F7(DQ1)
DDR_DQ2: D10.F2(DQ2)
DDR_DQ3: D10.F8(DQ3)
DDR_DQ4: D10.H3(DQ4)
DDR_DQ5: D10.H8(DQ5)
DDR_DQ6: D10.G2(DQ6)
DDR_DQ7: D10.H7(DQ7)
DDR_DQ8: D10.D7(DQ8)
DDR_DQ9: D10.C3(DQ9)
DDR_DQ10: D10.C8(DQ10)
DDR_DQ11: D10.C2(DQ11)
DDR_DQ12: D10.A7(DQ12)
DDR_DQ13: D10.A2(DQ13)
DDR_DQ14: D10.B8(DQ14)
DDR_DQ15: D10.A3(DQ15)
DDR_DQ16: D9.E3(DQ0)
DDR_DQ17: D9.F7(DQ1)
DDR_DQ18: D9.F2(DQ2)
DDR_DQ19: D9.F8(DQ3)
DDR_DQ20: D9.H3(DQ4)
DDR_DQ21: D9.H8(DQ5)
DDR_DQ22: D9.G2(DQ6)
DDR_DQ23: D9.H7(DQ7)
DDR_DQ24: D9.D7(DQ8)
DDR_DQ25: D9.C3(DQ9)
DDR_DQ26: D9.C8(DQ10)
DDR_DQ27: D9.C2(DQ11)
DDR_DQ28: D9.A7(DQ12)
DDR_DQ29: D9.A2(DQ13)
DDR_DQ30: D9.B8(DQ14)
DDR_DQ31: D9.A3(DQ15)
DDR_DQM0: D10.E7(LDM)
DDR_DQM1: D10.D3(UDM)
DDR_DQM2: D9.E7(LDM)
DDR_DQM3: D9.D3(UDM)
DDR_DQSN0: D10.G3(LDQS_N)
DDR_DQSN1: D10.B7(UDQS_N)
DDR_DQSN2: D9.G3(LDQS_N)
DDR_DQSN3: D9.B7(UDQS_N)
DDR_DQSP0: D10.F3(LDQS_P)
DDR_DQSP1: D10.C7(UDQS_P)
DDR_DQSP2: D9.F3(LDQS_P)
DDR_DQSP3: D9.C7(UDQS_P)
DDR_ODT: D9.K1(ODT) D10.K1(ODT)
DDR_RAS_N: D9.J3(~{RAS}) D10.J3(~{RAS})
DDR_RESET_N: D9.T2(RESETn) D10.T2(RESETn)
DDR_WE_N: D9.L3(~{WE}) D10.L3(~{WE})
DDR_ZQ0: D10.L8(ZQ) R174.1
DDR_ZQ1: D9.L8(ZQ) R173.1
VCC_DDR_REF: C285.2 C286.2 C287.1 C288.1 C289.1 C290.1 C291.1 C292.1 C293.1 C294.1 C295.1 D9.H1(VREFDQ) D9.M8(VREFCA) D10.H1(VREFDQ) D10.M8(VREFCA)

Not connected (* = marked no-connect by the designer): D9 J1(NC1)* J9(NC2)* L1(NC3)* L9(NC4)* M7(NC5)*; D10 J1(NC1)* J9(NC2)* L1(NC3)* L9(NC4)* M7(NC5)*

### Buses and harness runs
bus DDR_A<14..0>
bus DDR_BA<2..0>
bus DDR_DQ<31..0>

### Library data of the parts
C273 C274 C279 C280 = C1210-22uF/16V: Part_number: C0805-10uF/6.3V; Part_type: CAP; Value: C0805-10uF/6.3V; Schematic_Part: CAP; PCB_Footprint: C0805
C275-C278 C281-C313 = C0402-0.1uF/16V: as C351-C357 on sheet Z7_POWER1; Part_type: CAP; temperature: -55℃\+125℃; Schematic_Part: CAP; PCB_Footprint: C0402; datasheet: #DataSheet\C_Samsung_General Capacitors.pdf#
  C275-C278 C281-C284: Part_number: C0402-0.47uF/6.3V; Value: C0402-0.47uF/6.3V
  C285-C313: Part_number: C0402-0.1uF/16V; Value: C0402-0.1uF/16V
D9 D10 = MT41K256M16: Part_number: MT41K256M16HA-125IT
R173-R175 = R0402-10K: Manufacturer: SAMSUNG; Part_type: RES; Schematic_Part: RES; PCB_Footprint: R0402
  R173 R174: Part_number: R0402-240R/1%; Value: R0402-240R/1%
  R175: Part_number: R0402-82.5R/1%; Value: R0402-82.5R/1%

## Sheet Z7_BANK500_501.SchDoc
size A3
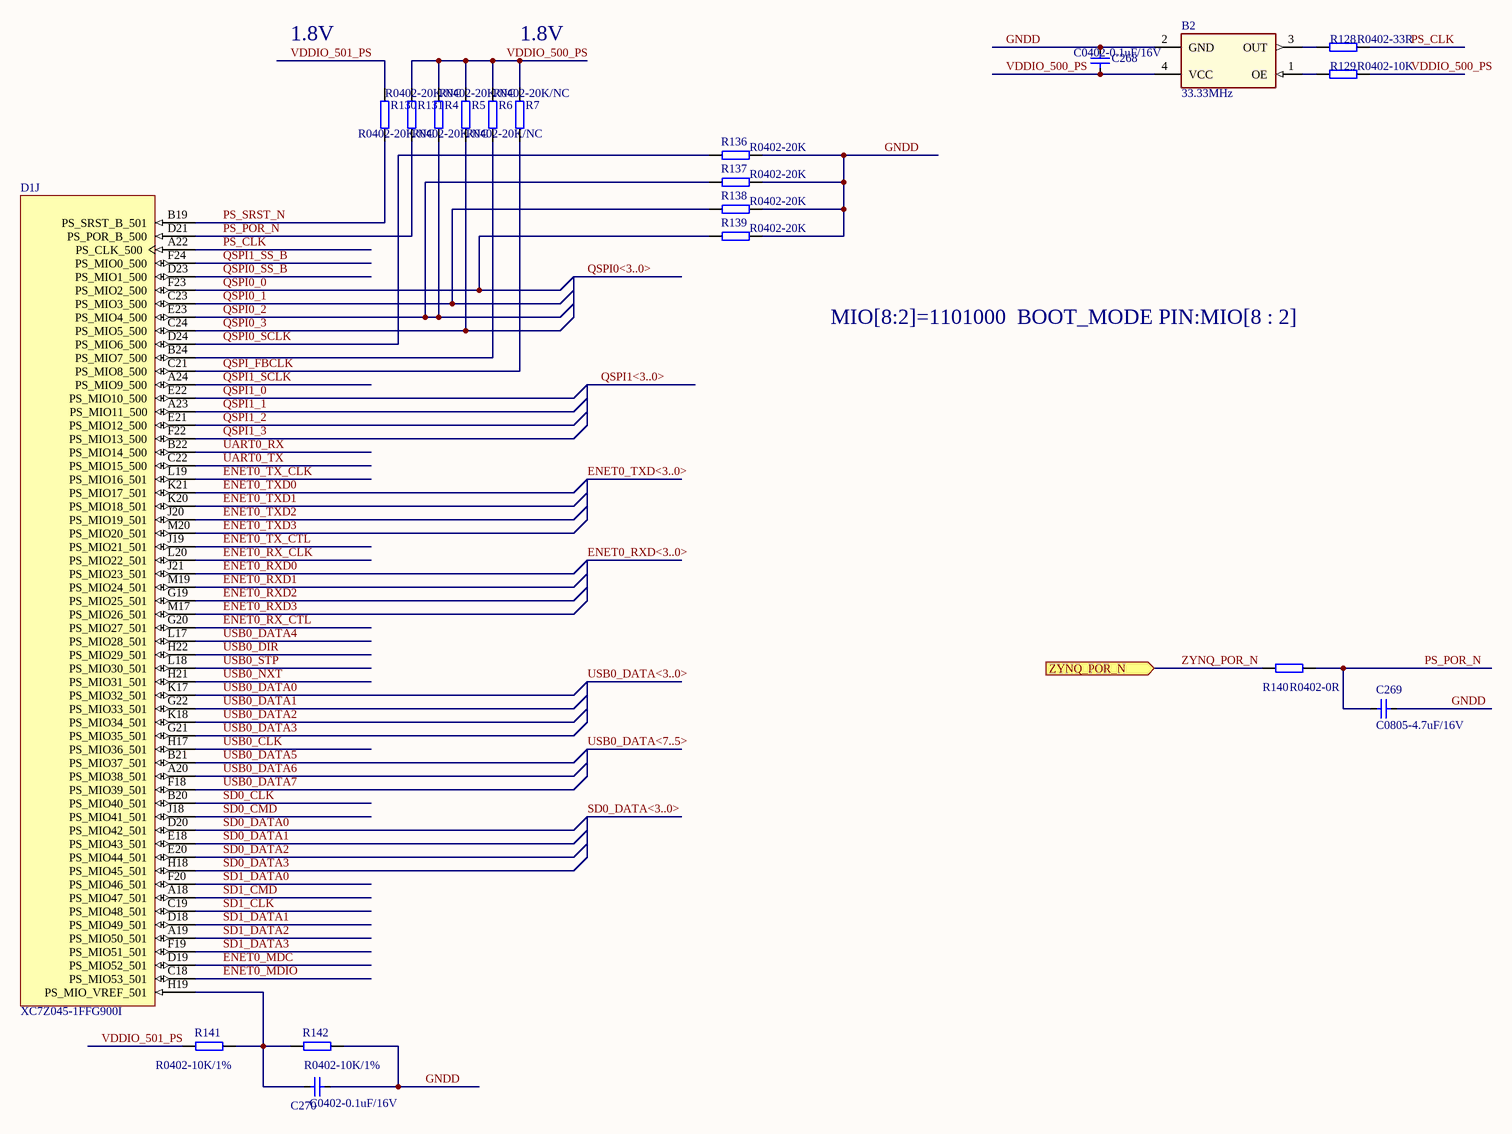
[diagram p29: Z7_BANK500_501.SchDoc]

### Parts
B2  33.33MHz  [OSC3225-4P]
C268  C0402-0.1uF/16V  [C0402]
C269  C0805-4.7uF/16V  [C0805]
C270  C0402-0.1uF/16V  [C0402]
D1  XC7Z045-1FFG900I  [FFG900]  (part J of 16)
R4  R0402-20K/NC  [R0402]
R5  R0402-20K/NC  [R0402]
R6  R0402-20K/NC  [R0402]
R7  R0402-20K/NC  [R0402]
R128  R0402-33R  [R0402]
R129  R0402-10K  [R0402]
R130  R0402-20K/NC  [R0402]
R131  R0402-20K/NC  [R0402]
R136  R0402-20K  [R0402]
R137  R0402-20K  [R0402]
R138  R0402-20K  [R0402]
R139  R0402-20K  [R0402]
R140  R0402-0R  [R0402]
R141  R0402-10K/1%  [R0402]
R142  R0402-10K/1%  [R0402]

### Ports
ZYNQ_POR_N (in)

### Nets
GNDD: B2.2(GND) C268.2 C269.2 C270.2 R136.1 R137.1 R138.1 R139.1 R142.1
VDDIO_500_PS: B2.4(VCC) C268.1 R4.2 R5.2 R6.2 R7.2 R129.2 R130.2 R131.2 R141.2  [also labelled VDDIO_501_PS]  [project net VCC1V8]
ENET0_MDC: D1.D19(PS_MIO52_501)
ENET0_MDIO: D1.C18(PS_MIO53_501)
ENET0_RX_CLK: D1.L20(PS_MIO22_501)
ENET0_RX_CTL: D1.G20(PS_MIO27_501)
ENET0_RXD0: D1.J21(PS_MIO23_501)
ENET0_RXD1: D1.M19(PS_MIO24_501)
ENET0_RXD2: D1.G19(PS_MIO25_501)
ENET0_RXD3: D1.M17(PS_MIO26_501)
ENET0_TX_CLK: D1.L19(PS_MIO16_501)
ENET0_TX_CTL: D1.J19(PS_MIO21_501)
ENET0_TXD0: D1.K21(PS_MIO17_501)
ENET0_TXD1: D1.K20(PS_MIO18_501)
ENET0_TXD2: D1.J20(PS_MIO19_501)
ENET0_TXD3: D1.M20(PS_MIO20_501)
PS_CLK: D1.A22(PS_CLK_500) R128.2
PS_POR_N: C269.1 D1.D21(PS_POR_B_500) R131.1 R140.2
PS_SRST_N: D1.B19(PS_SRST_B_501) R130.1
QSPI0_0: D1.F23(PS_MIO2_500) R139.2
QSPI0_1: D1.C23(PS_MIO3_500) R138.2
QSPI0_2: D1.E23(PS_MIO4_500) R4.1 R137.2
QSPI0_3: D1.C24(PS_MIO5_500) R5.1
QSPI0_SCLK: D1.D24(PS_MIO6_500) R136.2
QSPI0_SS_B: D1.D23(PS_MIO1_500)
QSPI1_0: D1.E22(PS_MIO10_500)
QSPI1_1: D1.A23(PS_MIO11_500)
QSPI1_2: D1.E21(PS_MIO12_500)
QSPI1_3: D1.F22(PS_MIO13_500)
QSPI1_SCLK: D1.A24(PS_MIO9_500)
QSPI1_SS_B: D1.F24(PS_MIO0_500)
QSPI_FBCLK: D1.C21(PS_MIO8_500) R7.1
SD0_CLK: D1.B20(PS_MIO40_501)
SD0_CMD: D1.J18(PS_MIO41_501)
SD0_DATA0: D1.D20(PS_MIO42_501)
SD0_DATA1: D1.E18(PS_MIO43_501)
SD0_DATA2: D1.E20(PS_MIO44_501)
SD0_DATA3: D1.H18(PS_MIO45_501)
SD1_CLK: D1.C19(PS_MIO48_501)
SD1_CMD: D1.A18(PS_MIO47_501)
SD1_DATA0: D1.F20(PS_MIO46_501)
SD1_DATA1: D1.D18(PS_MIO49_501)
SD1_DATA2: D1.A19(PS_MIO50_501)
SD1_DATA3: D1.F19(PS_MIO51_501)
UART0_RX: D1.B22(PS_MIO14_500)
UART0_TX: D1.C22(PS_MIO15_500)
USB0_CLK: D1.H17(PS_MIO36_501)
USB0_DATA0: D1.K17(PS_MIO32_501)
USB0_DATA1: D1.G22(PS_MIO33_501)
USB0_DATA2: D1.K18(PS_MIO34_501)
USB0_DATA3: D1.G21(PS_MIO35_501)
USB0_DATA4: D1.L17(PS_MIO28_501)
USB0_DATA5: D1.B21(PS_MIO37_501)
USB0_DATA6: D1.A20(PS_MIO38_501)
USB0_DATA7: D1.F18(PS_MIO39_501)
USB0_DIR: D1.H22(PS_MIO29_501)
USB0_NXT: D1.H21(PS_MIO31_501)
USB0_STP: D1.L18(PS_MIO30_501)
ZYNQ_POR_N: R140.1 ; port ZYNQ_POR_N
NetB2_1: B2.1(OE) R129.1
NetB2_3: B2.3(OUT) R128.1
NetC270_1: C270.1 D1.H19(PS_MIO_VREF_501) R141.1 R142.2
NetD1_B24: D1.B24(PS_MIO7_500) R6.1

### Buses and harness runs
bus ENET0_RXD<3..0>
bus ENET0_TXD<3..0>
bus QSPI0<3..0>
bus QSPI1<3..0>
bus SD0_DATA<3..0>
bus USB0_DATA<3..0>
bus USB0_DATA<7..5>

### Notes on the sheet
- 1.8V
- MIO[8:2]=1101000  BOOT_MODE PIN:MIO[8 : 2]

### Library data of the parts
B2 = XTAL-50MHz-3.3V: 有源晶振, 33.33MHz, 1.8V电压
C268 C270 = C0402-0.1uF/16V: as C351-C357 on sheet Z7_POWER1; Part_number: C0402-0.1uF/16V; Part_type: CAP; Value: C0402-0.1uF/16V; temperature: -55℃\+125℃; Schematic_Part: CAP; PCB_Footprint: C0402; datasheet: #DataSheet\C_Samsung_General Capacitors.pdf#
C269 = C0805-4.7uF/50V: X7R; Manufacturer: SAMSUNG; Part_number: C0805-4.7uF/16V; Part_type: CAP; Value: C0805-4.7uF/16V; Schematic_Part: CAP; PCB_Footprint: C0805; datasheet: #DataSheet\C_Samsung_General Capacitors.pdf#
D1 = XC7Z045-1FFG900I: as D1 on sheet Z7_POWER1; DatasheetVersion: v1.2; PackageVersion: Rev 1.1; PackageReference: FFG900; PackageDescription: Flip-Chip BGA, Body 31 x 31 mm, 1.0 mm Pitch; Generic Part Number: XC7Z045; RoHS: Pb-Free; Mounting Technology: Surface Mount; Code_JEDEC: MS-034-AAN-1; PartNumber: XC7Z045-1FFG900I; ComponentLink1Description: Datasheet; ComponentLink1URL: http://www.xilinx.com/support/documentation/data_sheets/ds190-Zynq-7000-Overview.pdf; ComponentLink2Description: Package Specification; ComponentLink2URL: http://www.xilinx.com/support/documentation/user_guides/ug865-Zynq-7000-Pkg-Pinout.pdf; ComponentLink3Description: DC and AC Switching Characteristics; ComponentLink3URL: http://www.xilinx.com/support/documentation/data_sheets/ds191-XC7Z030-XC7Z045-data-sheet.pdf; ComponentLink4Description: Package File; ComponentLink4URL: http://www.xilinx.com/support/packagefiles/z7packages/xc7z045ffg900pkg.txt; ComponentLink5Description: Packaging and Pinout; ComponentLink5URL: http://www.xilinx.com/support/documentation/user_guides/ug865-Zynq-7000-Pkg-Pinout.pdf; ComponentLink6Description: PCB and Layout Guide; ComponentLink6URL: http://www.xilinx.com/support/documentation/user_guides/ug483_7Series_PCB.pdf
R4-R7 R128-R131 R136-R142 = R0402-10K: Manufacturer: SAMSUNG; Part_type: RES; Schematic_Part: RES; PCB_Footprint: R0402
  R4-R7 R130 R131: Part_number: R0402-20K/NC; Value: R0402-20K/NC
  R128: Part_number: R0402-33R; Value: R0402-33R
  R129: Part_number: R0402-10K; Value: R0402-10K
  R136-R139: Part_number: R0402-20K; Value: R0402-20K
  R140: Part_number: R0402-0R; Value: R0402-0R
  R141 R142: Part_number: R0402-10K/1%; Value: R0402-10K/1%